# Altium project VM03_hv3.PrjPcb
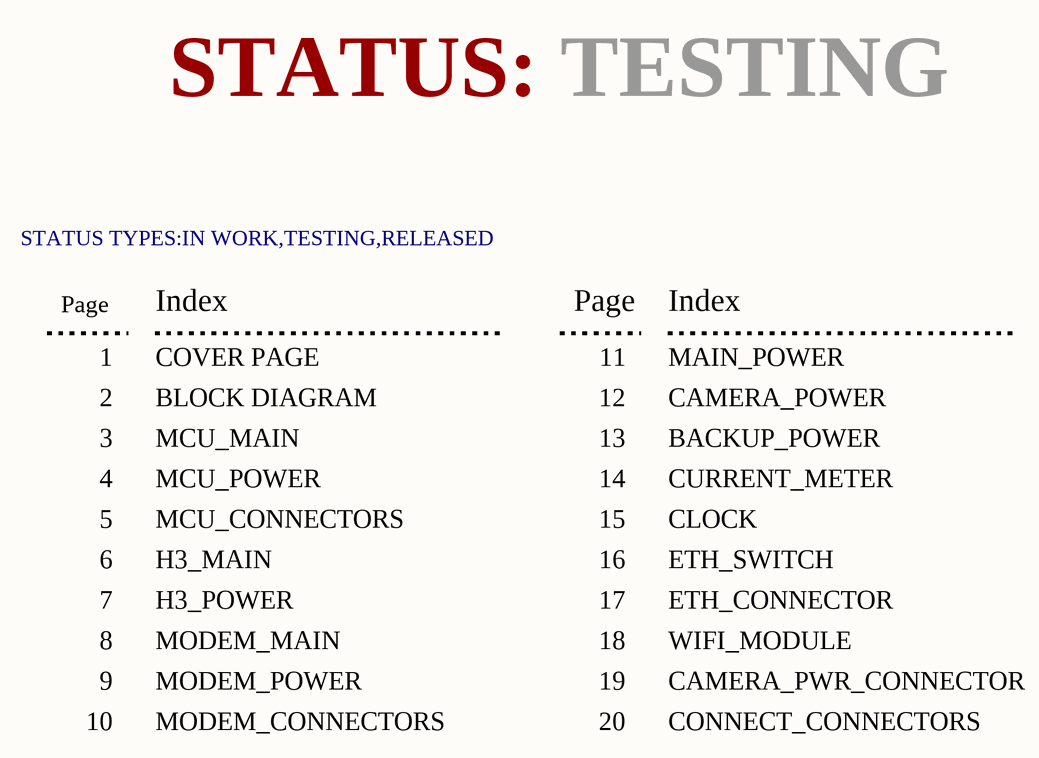
[diagram p0: [1]-COVER_PAGE.SchDoc]
20 sheets, 262 parts. Net scope: flat (ports and power ports of the same name join across sheets).
Board file: VM03_hv3.PcbDoc
Sheets:
  [1]-COVER_PAGE.SchDoc
  [2]-BLOCK_DIAGRAM.SchDoc
  [3]-MCU_MAIN.SchDoc
  [4]-MCU_POWER.SchDoc
  [5]-MCU_CONNECTORS.SchDoc
  [6]-H3_MAIN.SchDoc
  [7]-H3_POWER.SchDoc
  [8]-MODEM_MAIN.SchDoc
  [9]-MODEM_POWER.SchDoc
  [10]-MODEM_CONNECTORS.SchDoc
  [11]-MAIN_POWER.SchDoc
  [12]-CAMERA_POWER.SchDoc
  [13]-BACKUP_POWER.SchDoc
  [14]-CURRENT_METER.SchDoc
  [15]-CLOCK.SchDoc
  [16]-ETH_SWITCH.SchDoc
  [18]-WIFI_MODULE.SchDoc
  [19]-CAMERA_PWR_CONNECTORS.SchDoc
  [20]-CONNECT_CONNECTORS.SchDoc
  [21]-AXEL.SchDoc

## Sheet [1]-COVER_PAGE.SchDoc
size A4

### Notes on the sheet
- STATUS:
- TESTING
- STATUS TYPES:IN WORK,TESTING,RELEASED
- Page
- 1
- Index
- COVER PAGE
- 11
- MAIN_POWER
- 2
- BLOCK DIAGRAM
- 12
- CAMERA_POWER
- 3
- 4
- MCU_MAIN
- MCU_POWER
- 13
- 14
- BACKUP_POWER
- CURRENT_METER
- 5
- 6
- MCU_CONNECTORS
- H3_MAIN
- 15
- 16
- CLOCK
- ETH_SWITCH
- 7
- H3_POWER
- 17
- ETH_CONNECTOR
- 8
- 9
- MODEM_MAIN
- MODEM_POWER
- 18
- 19
- WIFI_MODULE
- CAMERA_PWR_CONNECTOR
- 10
- MODEM_CONNECTORS
- 20
- CONNECT_CONNECTORS

## Sheet [2]-BLOCK_DIAGRAM.SchDoc
size A4
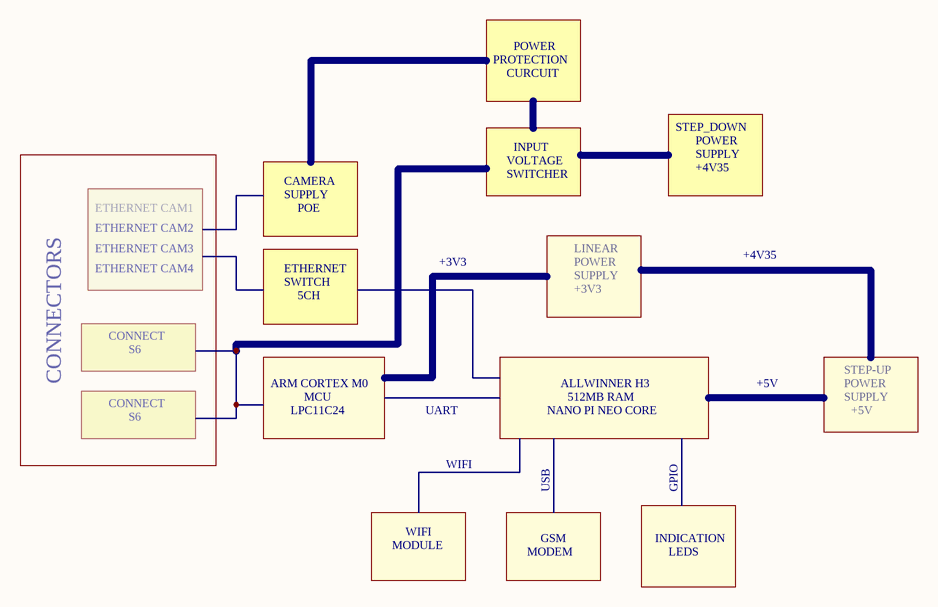
[diagram p1: [2]-BLOCK_DIAGRAM.SchDoc]

### Notes on the sheet
- POWER
- PROTECTION
- CURCUIT
- CAMERA
- VOLTAGE
- SWITCHER
- INPUT
- STEP_DOWN
- SUPPLY
- +4V35
- ETHERNET CAM1
- ETHERNET CAM2
- ETHERNET CAM3
- POE
- LINEAR
- ETHERNET CAM4
- ETHERNET
- SWITCH
- 5CH
- +3V3
- CONNECTORS
- CONNECT
- S6
- ARM CORTEX M0
- ALLWINNER H3
- +5V
- STEP-UP
- LPC11C24
- MCU
- UART
- NANO PI NEO CORE
- 512MB RAM
- WIFI
- USB
- GPIO
- MODULE
- MODEM
- GSM
- INDICATION
- LEDS

## Sheet [3]-MCU_MAIN.SchDoc
size A4
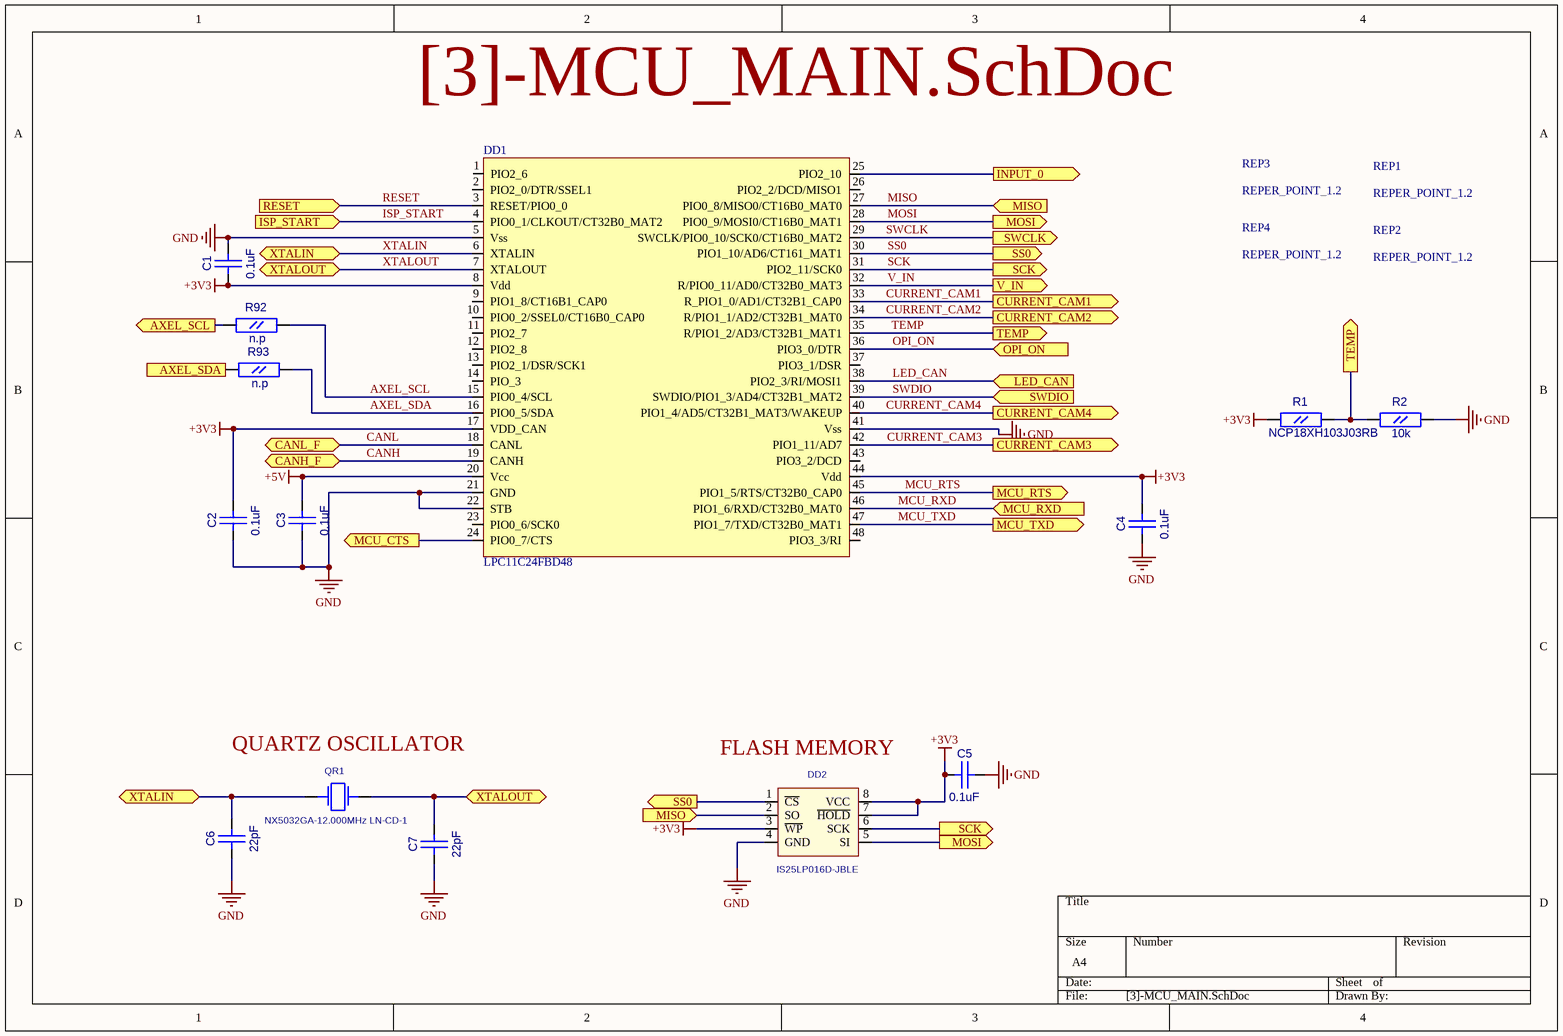
[diagram p2: [3]-MCU_MAIN.SchDoc]

### Parts
C1  0.1uF  [CC0603]
C2  0.1uF  [CC0603]
C3  0.1uF  [CC0603]
C4  0.1uF  [CC0603]
C5  0.1uF  [CC0603]
C6  22pF  [CC0603]
C7  22pF  [CC0603]
DD1  LPC11C24FBD48  [LQFP48]
DD2  IS25LP016D-JBLE  [EIAJ_SO8]
QR1  NX5032GA-12.000MHz LN-CD-1  [AC5032_2]
R1  NCP18XH103J03RB  [RC0603]
R2  10k  [RC0603]
R92  n.p  [RC0603]
R93  n.p  [RC0603]
REP1  REPER_POINT_1.2  [REPER1.2]
REP2  REPER_POINT_1.2  [REPER1.2]
REP3  REPER_POINT_1.2  [REPER1.2]
REP4  REPER_POINT_1.2  [REPER1.2]

### Ports
AXEL_SCL (out), AXEL_SDA (out), CANH_F (bidir), CANL_F (bidir), CURRENT_CAM1 (out), CURRENT_CAM2 (out), CURRENT_CAM3 (out), CURRENT_CAM4 (out), INPUT_0 (out), ISP_START (in), LED_CAN (in), MCU_CTS (out), MCU_RTS (out), MCU_RXD (in), MCU_TXD (out), MISO (in), MOSI (out), OPI_ON (in), RESET (in), SCK (out), SS0 (out), SWCLK (out), SWDIO (in), TEMP (out), V_IN (out), XTALIN (bidir), XTALOUT (bidir)

### Nets
+3V3: C1.1(A) C2.2(B) C4.2(B) C5.1(A) DD1.8(Vdd) DD1.17(VDD_CAN) DD1.44(Vdd) DD2.3(~{WP}) DD2.7(~{HOLD}) DD2.8(VCC) R1.1(A)
+5V: C3.2(B) DD1.20(Vcc)
GND: C1.2(B) C2.1(A) C3.1(A) C4.1(A) C5.2(B) C6.1(A) C7.1(A) DD1.5(Vss) DD1.21(GND) DD1.22(STB) DD1.41(Vss) DD2.4(GND) R2.2(B)
AXEL_SCL: DD1.15(PIO0_4/SCL) R92.2(B)
AXEL_SDA: DD1.16(PIO0_5/SDA) R93.2(B)
CANH: DD1.19(CANH) ; port CANH_F
CANL: DD1.18(CANL) ; port CANL_F
CURRENT_CAM1: DD1.33(R_PIO1_0/AD1/CT32B1_CAP0) ; port CURRENT_CAM1
CURRENT_CAM2: DD1.34(R/PIO1_1/AD2/CT32B1_MAT0) ; port CURRENT_CAM2
CURRENT_CAM3: DD1.42(PIO1_11/AD7) ; port CURRENT_CAM3
CURRENT_CAM4: DD1.40(PIO1_4/AD5/CT32B1_MAT3/WAKEUP) ; port CURRENT_CAM4
INPUT_0: DD1.25(PIO2_10) ; port INPUT_0
ISP_START: DD1.4(PIO0_1/CLKOUT/CT32B0_MAT2) ; port ISP_START
LED_CAN: DD1.38(PIO2_3/RI/MOSI1) ; port LED_CAN
MCU_RTS: DD1.45(PIO1_5/RTS/CT32B0_CAP0) ; port MCU_RTS
MCU_RXD: DD1.46(PIO1_6/RXD/CT32B0_MAT0) ; port MCU_RXD
MCU_TXD: DD1.47(PIO1_7/TXD/CT32B0_MAT1) ; port MCU_TXD
MISO: DD1.27(PIO0_8/MISO0/CT16B0_MAT0) DD2.2(SO) ; port MISO
MOSI: DD1.28(PIO0_9/MOSI0/CT16B0_MAT1) DD2.5(SI) ; port MOSI
OPI_ON: DD1.36(PIO3_0/DTR) ; port OPI_ON
RESET: DD1.3(RESET/PIO0_0) ; port RESET
SCK: DD1.31(PIO2_11/SCK0) DD2.6(SCK) ; port SCK
SS0: DD1.30(PIO1_10/AD6/CT161_MAT1) DD2.1(~{CS}) ; port SS0
SWCLK: DD1.29(SWCLK/PIO0_10/SCK0/CT16B0_MAT2) ; port SWCLK
SWDIO: DD1.39(SWDIO/PIO1_3/AD4/CT32B1_MAT2) ; port SWDIO
TEMP: DD1.35(R/PIO1_2/AD3/CT32B1_MAT1) R1.2(B) R2.1(A) ; port TEMP
V_IN: DD1.32(R/PIO0_11/AD0/CT32B0_MAT3) ; port V_IN
XTALIN: C6.2(B) DD1.6(XTALIN) QR1.1 ; port XTALIN
XTALOUT: C7.2(B) DD1.7(XTALOUT) QR1.2 ; port XTALOUT
NetDA6_2: R93.1(A) ; port AXEL_SDA
NetDA6_12: R92.1(A) ; port AXEL_SCL
NetDD1_24: DD1.24(PIO0_7/CTS) ; port MCU_CTS

Not connected (* = marked no-connect by the designer): DD1 1(PIO2_6) 2(PIO2_0/DTR/SSEL1) 9(PIO1_8/CT16B1_CAP0) 10(PIO0_2/SSEL0/CT16B0_CAP0) 11(PIO2_7) 12(PIO2_8) 13(PIO2_1/DSR/SCK1) 14(PIO_3) 23(PIO0_6/SCK0) 26(PIO2_2/DCD/MISO1) 37(PIO3_1/DSR) 43(PIO3_2/DCD) 48(PIO3_3/RI); REP1 1; REP2 1; REP3 1; REP4 1

### Notes on the sheet
- (near QR1) QUARTZ OSCILLATOR
- (near DD2) FLASH MEMORY

### Library data of the parts
C1-C7 = CC0603
  C1-C5: Value: 0.1uF
  C6 C7: Value: 22pF
DD2 = S25FL016A0LMFI01: Value: IS25LP016D-JBLE
QR1 = AC5032_2: AC5032/2; Value: NX5032GA-12.000MHz LN-CD-1
R1 R2 R92 R93 = RC0603
  R1: Value: NCP18XH103J03RB
  R2: Value: 10k
  R92 R93: Value: n.p
REP1-REP4 = REPER1.2: Value: REPER_POINT_1.2
DD1 = LPC11C24FBD48: Value: LPC11C24FBD48

## Sheet [4]-MCU_POWER.SchDoc
size A4
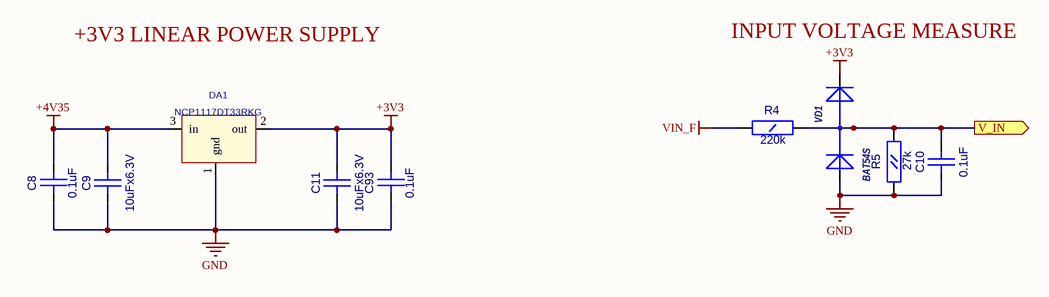
[diagram p3: [4]-MCU_POWER.SchDoc]

### Parts
C8  0.1uF  [CC0603]
C9  10uFx6.3V  [CC0805]
C10  0.1uF  [CC0603]
C11  10uFx6.3V  [CC0805]
C93  0.1uF  [CC0603]
DA1  NCP1117DT33RKG  [SOT-223]
R4  220k  [RC1206]
R5  27k  [RC0603]
VD1  BAT54S  [SOT-23(GSD)]

### Ports
V_IN (out)

### Nets
+3V3: C11.2(B) C93.1(A) DA1.2(out) VD1.2(K)
+4V35: C8.1(A) C9.2(B) DA1.3(in)
GND: C8.2(B) C9.1(A) C10.1(A) C11.1(A) C93.2(B) DA1.1(gnd) R5.1(A) VD1.1(A)
VIN_F: R4.1(A)
V_IN: C10.2(B) R4.2(B) R5.2(B) VD1.3(AK) ; port V_IN

### Notes on the sheet
- +3V3 LINEAR POWER SUPPLY
- (near VD1) INPUT VOLTAGE MEASURE

### Library data of the parts
C8 C10 C93 = CC0603: Value: 0.1uF
C9 C11 = CC0805: Value: 10uFx6.3V
DA1 = NCP1117DT33RKG: Linear Regulator 3.3V; Value: *
R4 = RC1206: Value: 220k
R5 = RC0603: Value: 27k
VD1 = BAT54S: 1.0 Ampere General Purpose Rectifier; ComponentField6: Published 8-Jun-2000, Modified 11-July-2000: SIM Model Added.; Value: *

## Sheet [5]-MCU_CONNECTORS.SchDoc
size A4
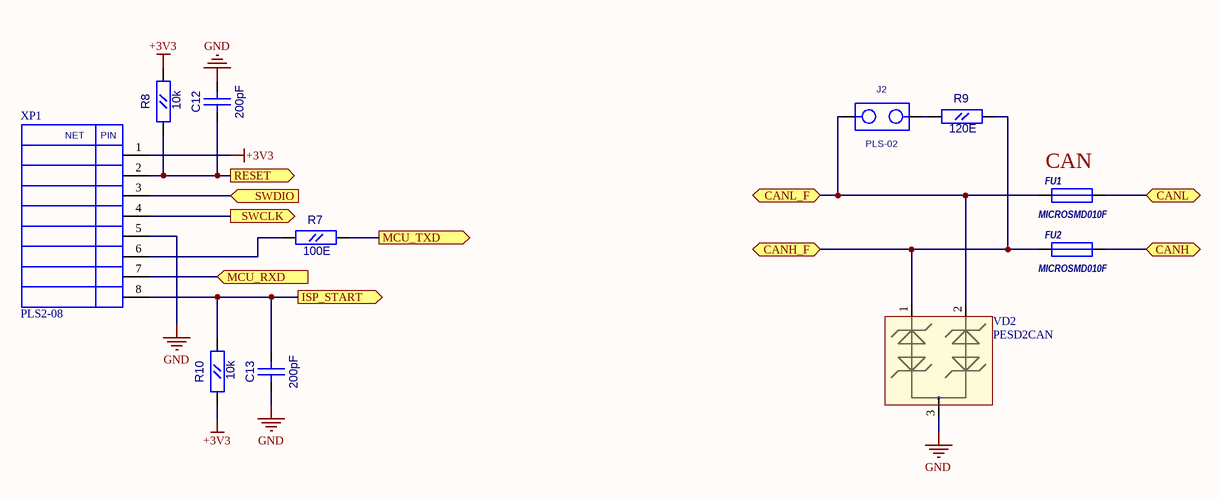
[diagram p4: [5]-MCU_CONNECTORS.SchDoc]

### Parts
C12  200pF  [CC0603]
C13  200pF  [CC0603]
FU1  MICROSMD010F  [RC1210]
FU2  MICROSMD010F  [RC1210]
J2  PLS-02  [PLS-02]
R7  100E  [RC0603]
R8  10k  [RC0603]
R9  120E  [RC0805]
R10  10k  [RC0603]
VD2  PESD2CAN  [SOT-23(123)]
XP1  PLS2-08  [PLS2-08]

### Ports
CANH (bidir), CANH_F (bidir), CANL (bidir), CANL_F (bidir), ISP_START (out), MCU_RXD (in), MCU_TXD (out), RESET (out), SWCLK (out), SWDIO (in)

### Nets
+3V3: R8.2(B) R10.1(A) XP1.1
GND: C12.2(B) C13.1(A) VD2.3 XP1.5
CANH: FU2.1 R9.2(B) VD2.1 ; port CANH_F
CANL: FU1.1 J2.1 VD2.2 ; port CANL_F
ISP_START: C13.2(B) R10.2(B) XP1.8 ; port ISP_START
MCU_RXD: XP1.7 ; port MCU_RXD
MCU_TXD: R7.2(B) ; port MCU_TXD
RESET: C12.1(A) R8.1(A) XP1.2 ; port RESET
SWCLK: XP1.4 ; port SWCLK
SWDIO: XP1.3 ; port SWDIO
NetFU1_2: FU1.2 ; port CANL
NetFU2_2: FU2.2 ; port CANH
NetJ2_2: J2.2 R9.1(A)
NetR7_1: R7.1(A) XP1.6

### Notes on the sheet
- (near FU1) CAN
- (in symbol PLS2-08) NET; PIN

### Library data of the parts
C12 C13 = CC0603: Value: 200pF
FU1 FU2 = MICROSMD: Value: *
R7 R8 R10 = RC0603
  R7: Value: 100E
  R8 R10: Value: 10k
R9 = RC0805: Value: 120E
VD2 = PESD2CAN: TVS for CAN
J2 = PLS-02: Value: *

## Sheet [6]-H3_MAIN.SchDoc
size A4
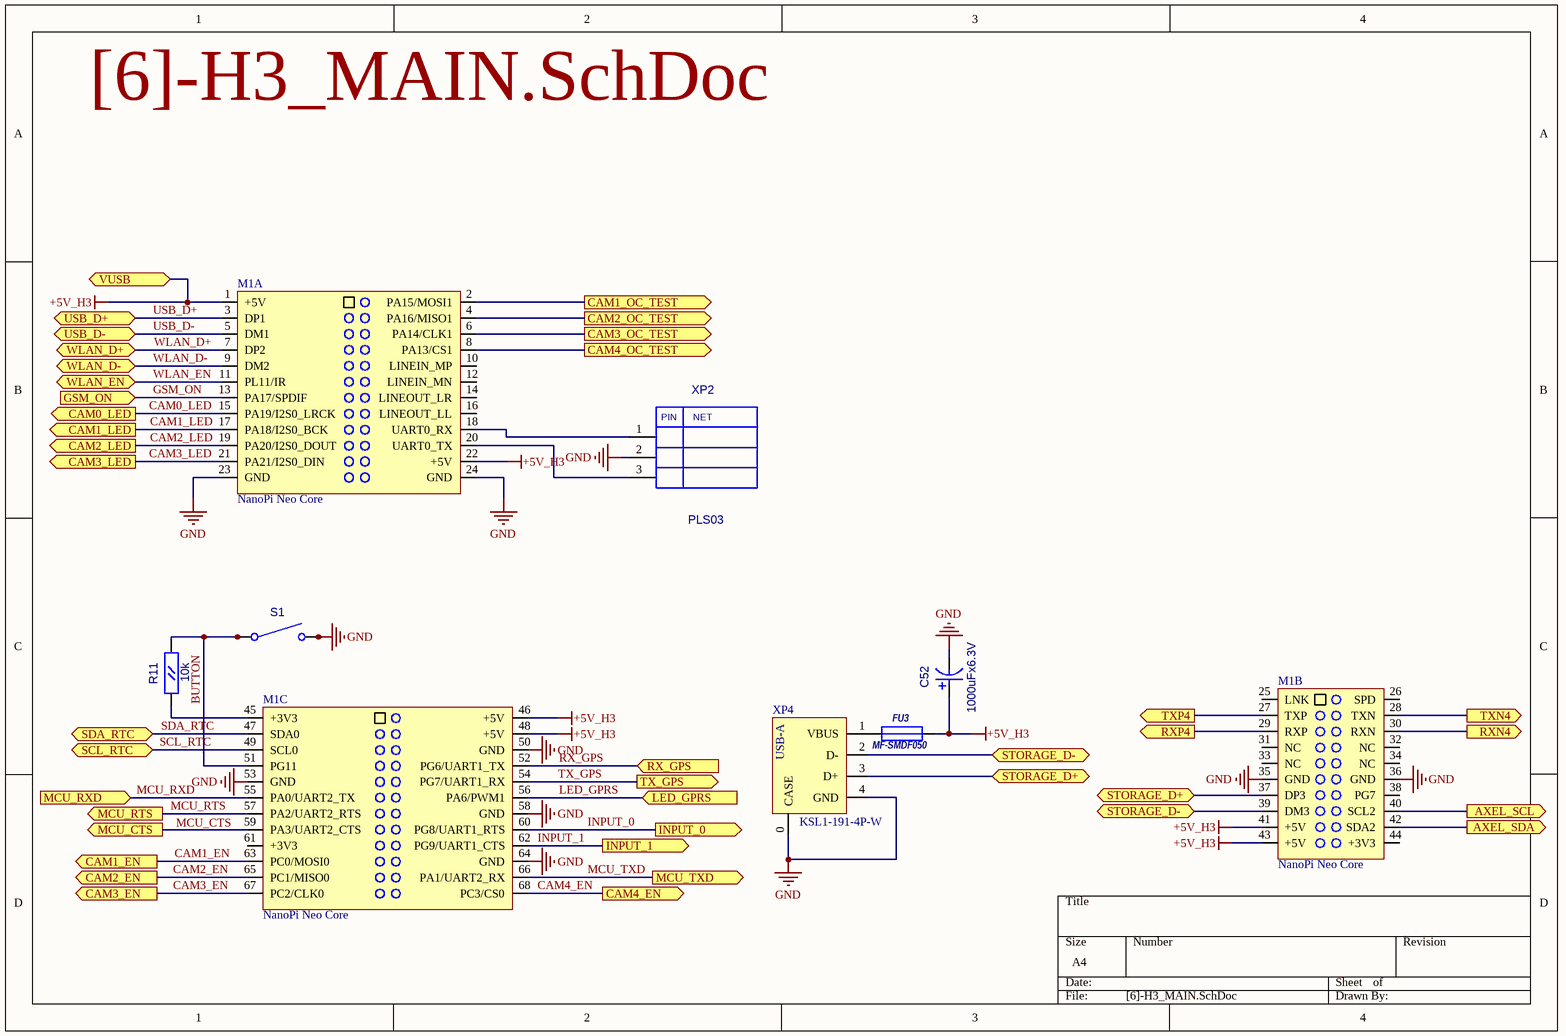
[diagram p5: [6]-H3_MAIN.SchDoc]

### Parts
C52  value 1000uFx6.3V  [CC8X3.5]  (hidden comment: CAP0.35)
FU3  MF-SMDF050  [MF-SMDF]
M1  NanoPi Neo Core  [NanoPiNeo_CORE]  (parts A,B,C of 3)
R11  10k  [RC0603]
S1  DTSM-61N  [DTSM-61N]  (value not drawn)
XP2  PLS03  [PLS-03]
XP4  KSL1-191-4P-W  [USB_A_REAR]

### Ports
AXEL_SCL (out), AXEL_SDA (out), CAM0_LED (out), CAM1_EN (out), CAM1_LED (out), CAM1_OC_TEST (out), CAM2_EN (out), CAM2_LED (out), CAM2_OC_TEST (out), CAM3_EN (out), CAM3_LED (out), CAM3_OC_TEST (out), CAM4_EN (out), CAM4_OC_TEST (out), GSM_ON (in), INPUT_0 (out), INPUT_1 (out), LED_GPRS (in), MCU_CTS (out), MCU_RTS (out), MCU_RXD (in), MCU_TXD (out), RX_GPS (in), RXN4 (out), RXP4 (out), SCL_RTC (bidir), SDA_RTC (bidir), STORAGE_D+ (bidir), STORAGE_D- (bidir), TX_GPS (out), TXN4 (out), TXP4 (out), USB_D+ (bidir), USB_D- (bidir), VUSB (bidir), WLAN_D+ (bidir), WLAN_D- (bidir), WLAN_EN (bidir)

### Nets
+5V_H3: C52.1 FU3.2 M1.1(+5V) M1.22(+5V) M1.41(+5V) M1.43(+5V) M1.46(+5V) M1.48(+5V) ; port VUSB  [project net VUSB]
GND: C52.2 M1.23(GND) M1.24(GND) M1.35(GND) M1.36(GND) M1.50(GND) M1.53(GND) M1.58(GND) M1.64(GND) S1.3(C2) S1.4 XP2.2 XP4.0(CASE) XP4.4(GND)
BUTTON: M1.51(PG11) R11.2(B) S1.1(C1) S1.2
CAM0_LED: M1.15(PA19/I2S0_LRCK) ; port CAM0_LED
CAM1_EN: M1.63(PC0/MOSI0) ; port CAM1_EN
CAM1_LED: M1.17(PA18/I2S0_BCK) ; port CAM1_LED
CAM2_EN: M1.65(PC1/MISO0) ; port CAM2_EN
CAM2_LED: M1.19(PA20/I2S0_DOUT) ; port CAM2_LED
CAM3_EN: M1.67(PC2/CLK0) ; port CAM3_EN
CAM3_LED: M1.21(PA21/I2S0_DIN) ; port CAM3_LED
CAM4_EN: M1.68(PC3/CS0) ; port CAM4_EN
GSM_ON: M1.13(PA17/SPDIF) ; port GSM_ON
INPUT_0: M1.60(PG8/UART1_RTS) ; port INPUT_0
INPUT_1: M1.62(PG9/UART1_CTS) ; port INPUT_1
LED_GPRS: M1.56(PA6/PWM1) ; port LED_GPRS
MCU_RTS: M1.57(PA2/UART2_RTS) ; port MCU_RTS
MCU_RXD: M1.55(PA0/UART2_TX) ; port MCU_RXD
MCU_TXD: M1.66(PA1/UART2_RX) ; port MCU_TXD
RX_GPS: M1.52(PG6/UART1_TX) ; port RX_GPS
SCL_RTC: M1.49(SCL0) ; port SCL_RTC
SDA_RTC: M1.47(SDA0) ; port SDA_RTC
TX_GPS: M1.54(PG7/UART1_RX) ; port TX_GPS
USB_D+: M1.3(DP1) ; port USB_D+
USB_D-: M1.5(DM1) ; port USB_D-
WLAN_D+: M1.7(DP2) ; port WLAN_D+
WLAN_D-: M1.9(DM2) ; port WLAN_D-
WLAN_EN: M1.11(PL11/IR) ; port WLAN_EN
NetC82_2: M1.2(PA15/MOSI1) ; port CAM1_OC_TEST
NetC83_2: M1.6(PA14/CLK1) ; port CAM3_OC_TEST
NetC84_2: M1.8(PA13/CS1) ; port CAM4_OC_TEST
NetC85_2: M1.4(PA16/MISO1) ; port CAM2_OC_TEST
NetDA6_2: M1.42(SDA2) ; port AXEL_SDA
NetDA6_12: M1.40(SCL2) ; port AXEL_SCL
NetDD1_24: M1.59(PA3/UART2_CTS) ; port MCU_CTS
NetDD4_19: M1.27(TXP) ; port TXP4
NetDD4_20: M1.28(TXN) ; port TXN4
NetDD4_21: M1.30(RXN) ; port RXN4
NetDD4_22: M1.29(RXP) ; port RXP4
NetFU3_1: FU3.1 XP4.1(VBUS)
NetM1_18: M1.18(UART0_RX) XP2.1
NetM1_20: M1.20(UART0_TX) XP2.3
NetM1_37: M1.37(DP3) XP4.3(D+) ; port STORAGE_D+
NetM1_39: M1.39(DM3) XP4.2(D-) ; port STORAGE_D-
NetM1_45: M1.45(+3V3) R11.1(A)

Not connected (* = marked no-connect by the designer): M1 10(LINEIN_MP) 12(LINEIN_MN) 14(LINEOUT_LR) 16(LINEOUT_LL) 25(LNK) 26(SPD) 31(NC) 32(NC) 33(NC) 34(NC) 38(PG7) 44(+3V3) 61(+3V3)

### Notes on the sheet
- Labels drawn without touching a wire or pin: MCU_CTS
- (in symbol PLS03) PIN; NET
- (in symbol USB_A_REAR) USB-A

### Library data of the parts
FU3 = MF-SMDF: Value: *
M1 = NanoPi Neo Core: Nano Pi Neo Core Allwinner H3 based embedded module; Value: NanoPi Neo Core
R11 = RC0603: Value: 10k
S1 = DTSM-61N: Switch, Single Pole, Single Throw, Normally Open; Value: {Value}
XP4 = USB_A_REAR: USB A rear side connector; Value: KSL1-191-4P-W
XP2 = PLS03: Value: *

## Sheet [7]-H3_POWER.SchDoc
size A4
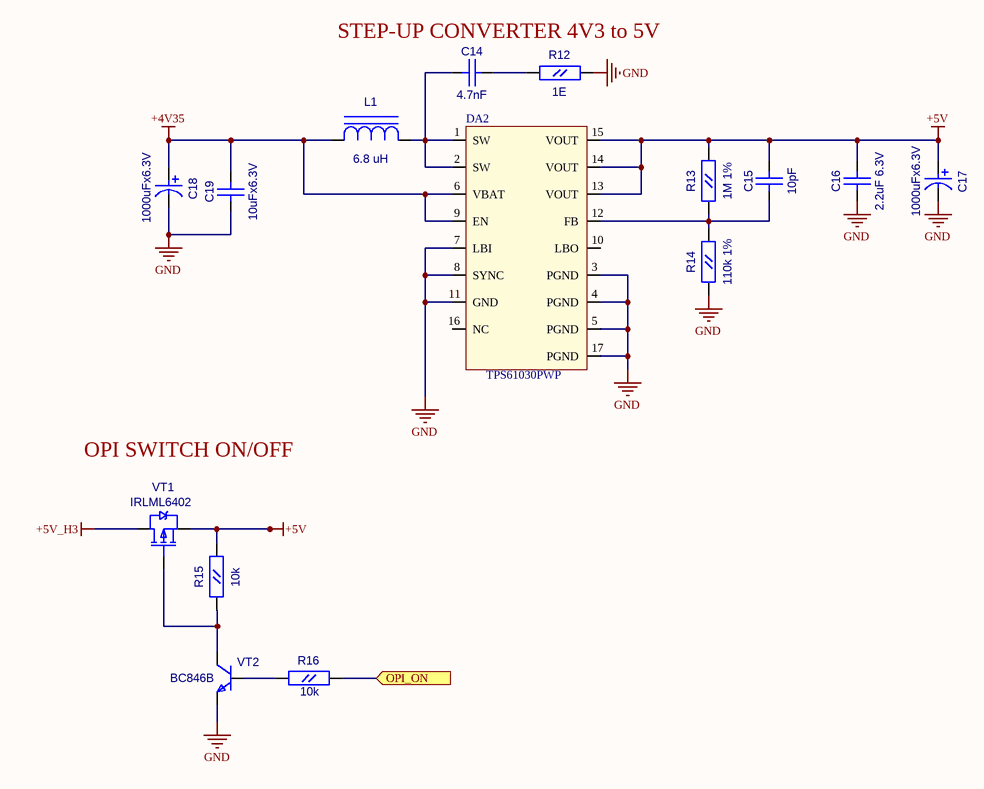
[diagram p6: [7]-H3_POWER.SchDoc]

### Parts
C14  4.7nF  [CC0603]
C15  10pF  [CC0603]
C16  2.2uF 6.3V  [CC0805]
C17  value 1000uFx6.3V  [CC8X3.5]  (hidden comment: CAP0.35)
C18  value 1000uFx6.3V  [CC8X3.5]  (hidden comment: CAP0.35)
C19  10uFx6.3V  [CC0805]
DA2  TPS61030PWP  [R-PDSO-G16]
L1  6.8 uH  [SDR0805]
R12  1E  [RC0603]
R13  1M 1%  [RC0603]
R14  110k 1%  [RC0603]
R15  10k  [RC0603]
R16  10k  [RC0603]
VT1  IRLML6402  [SOT-23(123)]
VT2  BC846B  [SOT-23(123)]

### Ports
OPI_ON (in)

### Nets
+4V35: C18.1 C19.2(B) DA2.6(VBAT) DA2.9(EN) L1.1(C)
+5V: C15.2(B) C16.2(B) C17.1 DA2.13(VOUT) DA2.14(VOUT) DA2.15(VOUT) R13.2(B) R15.2(B) VT1.2(S)
+5V_H3: VT1.3(D)  [project net VUSB]
GND: C16.1(A) C17.2 C18.2 C19.1(A) DA2.3(PGND) DA2.4(PGND) DA2.5(PGND) DA2.7(LBI) DA2.8(SYNC) DA2.11(GND) DA2.17(PGND) R12.2(B) R14.1(A) VT2.2(E)
OPI_ON: R16.2(B) ; port OPI_ON
NetC14_1: C14.1(A) DA2.1(SW) DA2.2(SW) L1.2(A)
NetC14_2: C14.2(B) R12.1(A)
NetC15_1: C15.1(A) DA2.12(FB) R13.1(A) R14.2(B)
NetR15_1: R15.1(A) VT1.1(G) VT2.3(C)
NetR16_1: R16.1(A) VT2.1(B)

Not connected (* = marked no-connect by the designer): DA2 10(LBO) 16(NC)

### Notes on the sheet
- STEP-UP CONVERTER 4V3 to 5V
- OPI SWITCH ON/OFF

### Library data of the parts
C14 C15 = CC0603
  C14: Value: 4.7nF
  C15: Value: 10pF
C16 C19 = CC0805
  C16: Value: 2.2uF 6.3V
  C19: Value: 10uFx6.3V
DA2 = TPS61030PWP: Boost converter
L1 = SDR0805: Value: 6.8 uH
R12-R16 = RC0603
  R12: Value: 1E
  R13: Value: 1M 1%
  R14: Value: 110k 1%
  R15 R16: Value: 10k
VT1 = IRLML6402: HEXFET Power MOSFET; OriginalName: IRLML5103; ComponentField7: Published 8-Jun-2000; Value: IRLML6402
VT2 = BC846BLT1: ComponentField7: Published 29-Sep-2000; OriginalName: BC846BLT1; Value: BC846B

## Sheet [8]-MODEM_MAIN.SchDoc
size A4
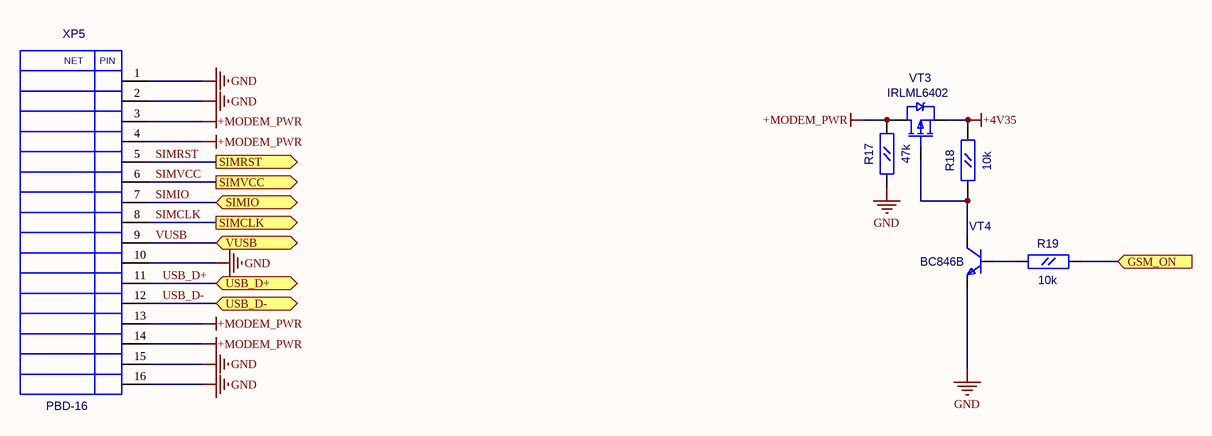
[diagram p7: [8]-MODEM_MAIN.SchDoc]

### Parts
R17  47k  [RC0603]
R18  10k  [RC0603]
R19  10k  [RC0603]
VT3  IRLML6402  [SOT-23(123)]
VT4  BC846B  [SOT-23(123)]
XP5  PBD-16  [PBD16]

### Ports
GSM_ON (in), SIMCLK (out), SIMIO (bidir), SIMRST (out), SIMVCC (out), USB_D+ (bidir), USB_D- (bidir), VUSB (bidir)

### Nets
+4V35: R18.2(B) VT3.2(S)
+MODEM_PWR: R17.2(B) VT3.3(D) XP5.3 XP5.4 XP5.13 XP5.14
GND: R17.1(A) VT4.2(E) XP5.1 XP5.2 XP5.10 XP5.15 XP5.16
VUSB: XP5.9 ; port VUSB
GSM_ON: R19.2(B) ; port GSM_ON
SIMCLK: XP5.8 ; port SIMCLK
SIMIO: XP5.7 ; port SIMIO
SIMRST: XP5.5 ; port SIMRST
SIMVCC: XP5.6 ; port SIMVCC
USB_D+: XP5.11 ; port USB_D+
USB_D-: XP5.12 ; port USB_D-
NetR18_1: R18.1(A) VT3.1(G) VT4.3(C)
NetR19_1: R19.1(A) VT4.1(B)

### Notes on the sheet
- (in symbol PBD-16) NET; PIN

### Library data of the parts
R17-R19 = RC0603
  R17: Value: 47k
  R18 R19: Value: 10k
VT3 = IRLML6402: as VT1 on sheet [7]-H3_POWER; Value: IRLML6402
VT4 = BC846BLT1: ComponentField7: Published 29-Sep-2000; OriginalName: BC846BLT1; Value: BC846B
XP5 = PBD-16: Value: *

## Sheet [9]-MODEM_POWER.SchDoc
size A4
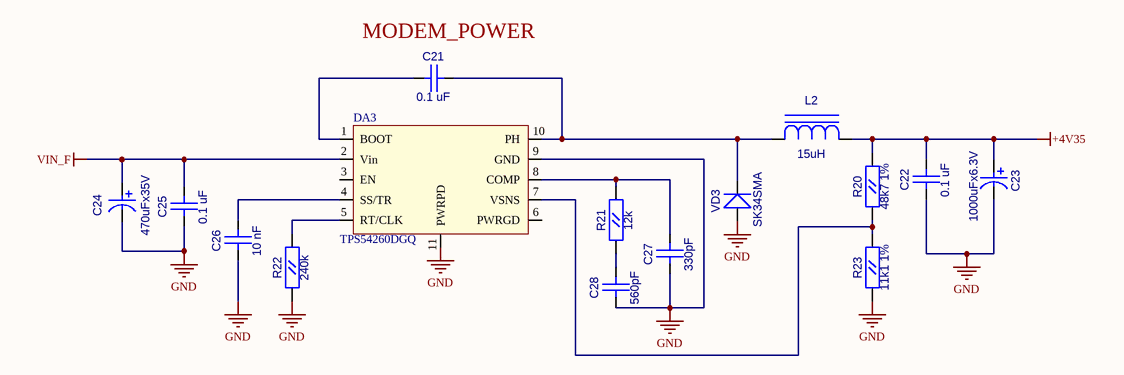
[diagram p8: [9]-MODEM_POWER.SchDoc]

### Parts
C21  0.1 uF  [CC0603]
C22  0.1 uF  [CC0603]
C23  1000uFx6.3V  [CC8X3.5]
C24  470uFx35V  [CC16X10_CAP0.5(1)(Primary)]
C25  0.1 uF  [CC0603]
C26  10 nF  [CC0603]
C27  330pF  [CC0603]
C28  560pF  [CC0603]
DA3  TPS54260DGQ  [S-PDSO-G10]
L2  15uH  [SDR0805]
R20  48k7 1%  [RC0603]
R21  12k  [RC0603]
R22  240k  [RC0603]
R23  11k1 1%  [RC0603]
VD3  SK34SMA  [SMA]

### Nets
+4V35: C22.1(A) C23.1 L2.2(A) R20.2(B)
GND: C22.2(B) C23.2 C24.1 C25.2(B) C26.2(B) C27.2(B) C28.2(B) DA3.9(GND) DA3.11(PWRPD) R22.1(A) R23.1(A) VD3.1(A)
VIN_F: C24.2 C25.1(A) DA3.2(Vin)
NetC21_1: C21.1(A) DA3.10(PH) L2.1(C) VD3.2(K)
NetC21_2: C21.2(B) DA3.1(BOOT)
NetC26_1: C26.1(A) DA3.4(SS/TR)
NetC27_1: C27.1(A) DA3.8(COMP) R21.2(B)
NetC28_1: C28.1(A) R21.1(A)
NetDA3_5: DA3.5(RT/CLK) R22.2(B)
NetDA3_7: DA3.7(VSNS) R20.1(A) R23.2(B)

Not connected (* = marked no-connect by the designer): DA3 3(EN) 6(PWRGD)

### Notes on the sheet
- (near C21) MODEM_POWER

### Library data of the parts
C21 C22 C25-C28 = CC0603
  C21 C22 C25: Value: 0.1 uF
  C26: Value: 10 nF
  C27: Value: 330pF
  C28: Value: 560pF
C23 = CAP0.35: Value: 1000uFx6.3V
C24 = CAP0.5(1): Value: 470uFx35V
L2 = SDR0805: Value: 15uH
R20-R23 = RC0603
  R20: Value: 48k7 1%
  R21: Value: 12k
  R22: Value: 240k
  R23: Value: 11k1 1%
VD3 = SK34SMA: Schottky Rectifier; Value: {Value}

## Sheet [10]-MODEM_CONNECTORS.SchDoc
size A4
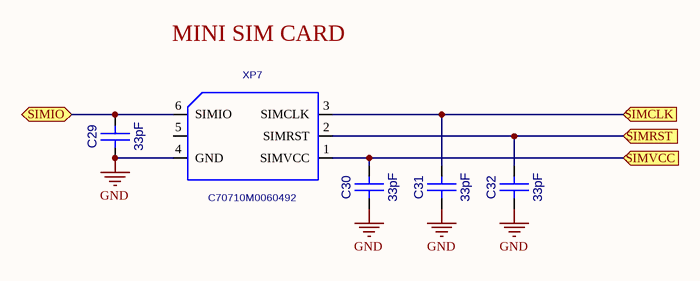
[diagram p9: [10]-MODEM_CONNECTORS.SchDoc]

### Parts
C29  33pF  [CC0603]
C30  33pF  [CC0603]
C31  33pF  [CC0603]
C32  33pF  [CC0603]
XP7  C70710M0060492  [SCVW06A25020]

### Ports
SIMCLK (in), SIMIO (bidir), SIMRST (in), SIMVCC (in)

### Nets
GND: C29.1(A) C30.1(A) C31.1(A) C32.1(A) XP7.4(GND)
SIMCLK: C31.2(B) XP7.3(SIMCLK) ; port SIMCLK
SIMIO: C29.2(B) XP7.6(SIMIO) ; port SIMIO
SIMRST: C32.2(B) XP7.2(SIMRST) ; port SIMRST
SIMVCC: C30.2(B) XP7.1(SIMVCC) ; port SIMVCC

Not connected (* = marked no-connect by the designer): XP7 5

### Notes on the sheet
- MINI SIM CARD

### Library data of the parts
C29-C32 = CC0603: Value: 33pF
XP7 = SCV-W06A25-020: Value: *

## Sheet [11]-MAIN_POWER.SchDoc
size A4
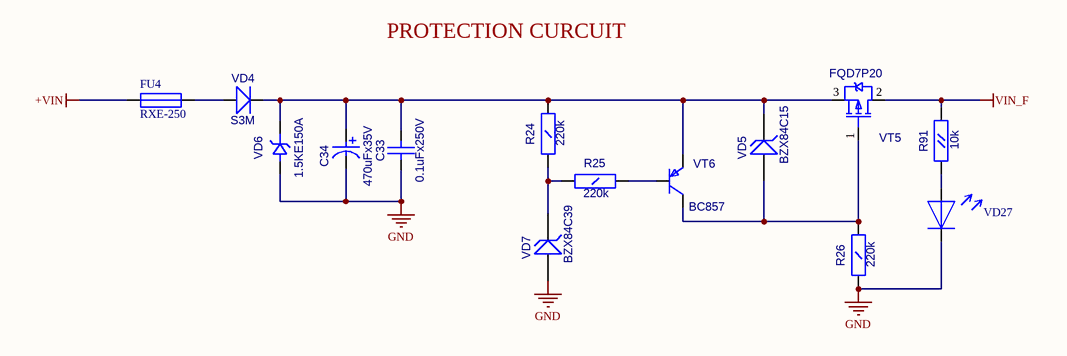
[diagram p10: [11]-MAIN_POWER.SchDoc]

### Parts
C33  0.1uFx250V  [CC1206]
C34  value 470uFx35V  [CC16X10_CAP0.5(1)(Primary)]  (hidden comment: CAP0.5(1))
FU4  RXE-250  [RXE-250_FLAT]
R24  220k  [RC1206]
R25  220k  [RC1206]
R26  220k  [RC1206]
R91  10k  [RC0603]
VD4  S3M  [SMC]
VD5  BZX84C15  [SOT-23(123)]
VD6  1.5KE150A  [DO-201_FLAT]
VD7  BZX84C39  [SOT-23(123)]
VD27  LED_0805  [LED0805]  (value not drawn)
VT5  FQD7P20  [D-PAK(TO-252AA)]
VT6  BC857  [SOT-23(123)]

### Nets
+VIN: FU4.1
GND: C33.1(A) C34.1 R26.1(A) VD6.1(A) VD7.1(A) VD27.2
VIN_F: R91.2(B) VT5.2(D)
NetC33_2: C33.2(B) C34.2 R24.2(B) VD4.2(K) VD5.3(K) VD6.2(K) VT5.3(S) VT6.2(E)
NetFU4_2: FU4.2 VD4.1(A)
NetR24_1: R24.1(A) R25.1(A) VD7.3(K)
NetR25_2: R25.2(B) VT6.1(B)
NetR26_2: R26.2(B) VD5.1(A) VT5.1(G) VT6.3(C)
NetR91_1: R91.1(A) VD27.1

### Notes on the sheet
- PROTECTION CURCUIT

### Library data of the parts
C33 = CC1206: Value: 0.1uFx250V
R24-R26 = RC1206: Value: 220k
R91 = RC0603: Value: 10k
VD4 = S3A: Schottky Rectifier; Value: S3M
VD5 VD7 = BZX84: Zener Voltage Regulator Diode
  VD5: Value: BZX84C15
  VD7: Value: BZX84C39
VD6 = 1.5KE: Value: 1.5KE150A
VT5 = IRFR9220: HEXFET Power MOSFET; OriginalName: IRLML5103; ComponentField7: Published 8-Jun-2000; Value: FQD7P20
VT6 = BC857B: PNP 100ma transistor; OriginalName: BC846BLT1; ComponentField7: Published 29-Sep-2000; Value: BC857
FU4 = RXE-250: Value: RXE-250
VD27 = LED_0805: Value: LED_0805

## Sheet [12]-CAMERA_POWER.SchDoc
size A4
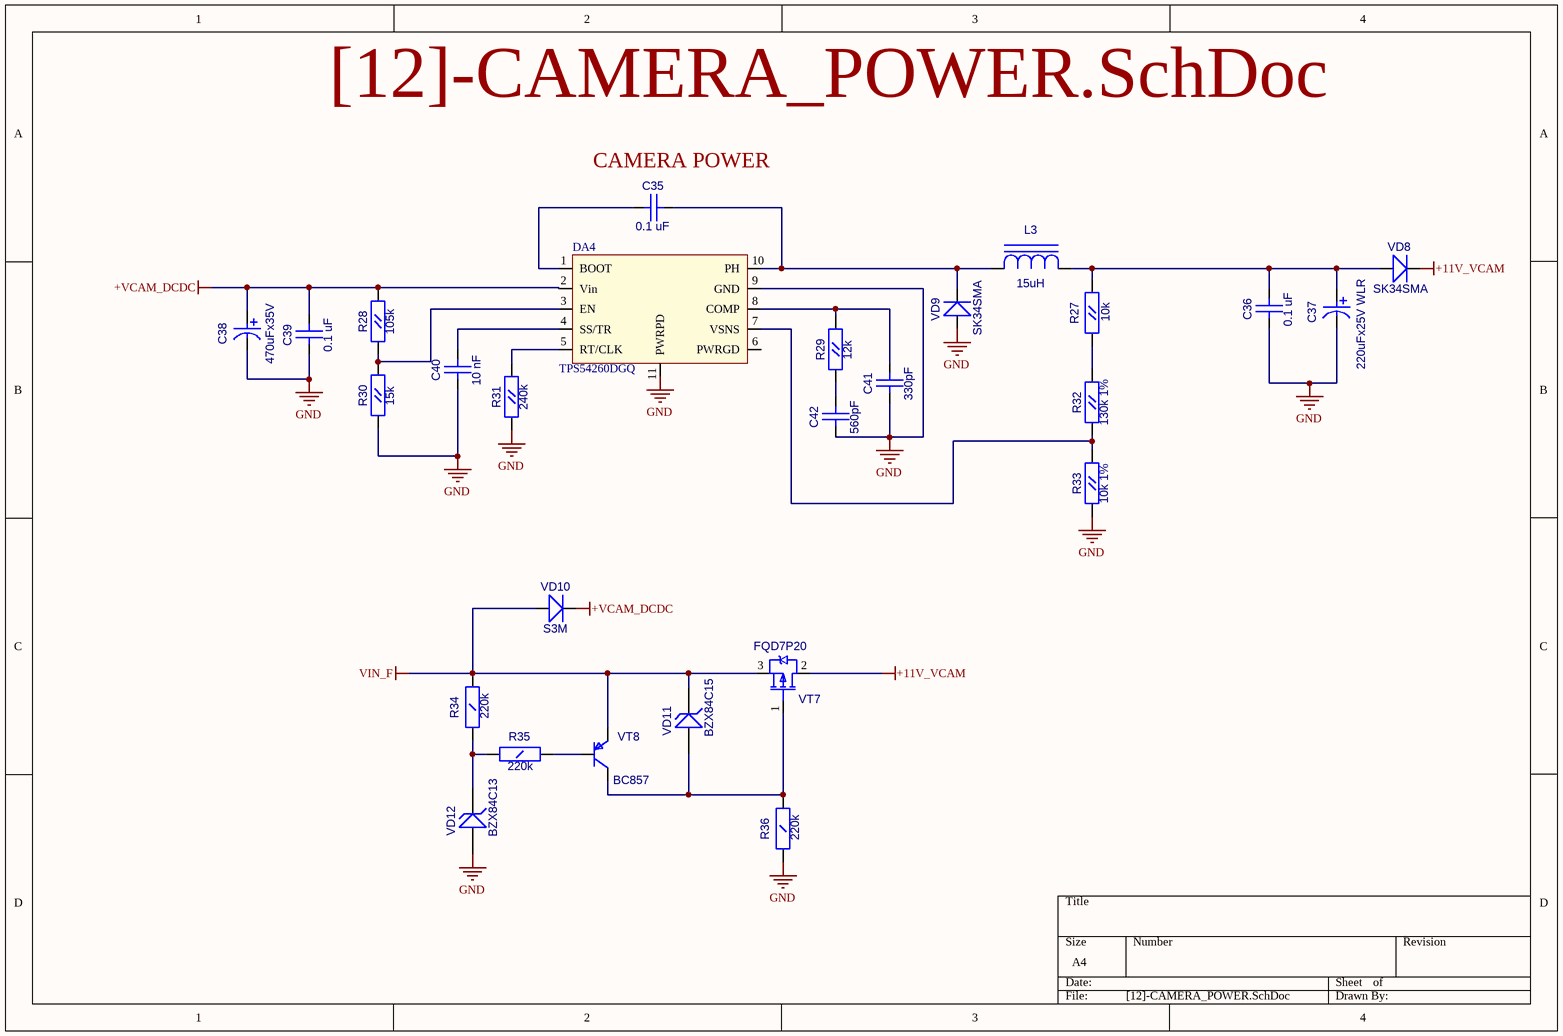
[diagram p11: [12]-CAMERA_POWER.SchDoc]

### Parts
C35  0.1 uF  [CC0603]
C36  0.1 uF  [CC0603]
C37  220uFx25V WLR  [CC8X3.5]
C38  470uFx35V  [CC16X10_CAP0.5(1)(Primary)]
C39  0.1 uF  [CC0603]
C40  10 nF  [CC0603]
C41  330pF  [CC0603]
C42  560pF  [CC0603]
DA4  TPS54260DGQ  [S-PDSO-G10]
L3  15uH  [SDR0805]
R27  10k  [RC0603]
R28  105k  [RC0603]
R29  12k  [RC0603]
R30  15k  [RC0603]
R31  240k  [RC0603]
R32  130k 1%  [RC0603]
R33  10k 1%  [RC0603]
R34  220k  [RC1206]
R35  220k  [RC1206]
R36  220k  [RC1206]
VD8  SK34SMA  [SMA]
VD9  SK34SMA  [SMA]
VD10  S3M  [SMC]
VD11  BZX84C15  [SOT-23(123)]
VD12  BZX84C13  [SOT-23(123)]
VT7  FQD7P20  [D-PAK(TO-252AA)]
VT8  BC857  [SOT-23(123)]

### Nets
+11V_VCAM: VD8.2(K) VT7.2(D)
+VCAM_DCDC: C38.2 C39.1(A) DA4.2(Vin) R28.2(B) VD10.2(K)
GND: C36.2(B) C37.2 C38.1 C39.2(B) C40.2(B) C41.2(B) C42.2(B) DA4.9(GND) DA4.11(PWRPD) R30.1(A) R31.1(A) R33.1(A) R36.1(A) VD9.1(A) VD12.1(A)
VIN_F: R34.2(B) VD10.1(A) VD11.3(K) VT7.3(S) VT8.2(E)
NetC35_1: C35.1(A) DA4.10(PH) L3.1(C) VD9.2(K)
NetC35_2: C35.2(B) DA4.1(BOOT)
NetC36_1: C36.1(A) C37.1 L3.2(A) R27.2(B) VD8.1(A)
NetC40_1: C40.1(A) DA4.4(SS/TR)
NetC41_1: C41.1(A) DA4.8(COMP) R29.2(B)
NetC42_1: C42.1(A) R29.1(A)
NetDA4_3: DA4.3(EN) R28.1(A) R30.2(B)
NetDA4_5: DA4.5(RT/CLK) R31.2(B)
NetDA4_7: DA4.7(VSNS) R32.1(A) R33.2(B)
NetR27_1: R27.1(A) R32.2(B)
NetR34_1: R34.1(A) R35.1(A) VD12.3(K)
NetR35_2: R35.2(B) VT8.1(B)
NetR36_2: R36.2(B) VD11.1(A) VT7.1(G) VT8.3(C)

Not connected (* = marked no-connect by the designer): DA4 6(PWRGD)

### Notes on the sheet
- (near C35) CAMERA POWER

### Library data of the parts
C35 C36 C39-C42 = CC0603
  C35 C36 C39: Value: 0.1 uF
  C40: Value: 10 nF
  C41: Value: 330pF
  C42: Value: 560pF
C37 = CAP0.35: Value: 220uFx25V WLR
C38 = CAP0.5(1): Value: 470uFx35V
L3 = SDR0805: Value: 15uH
R27-R33 = RC0603
  R27: Value: 10k
  R28: Value: 105k
  R29: Value: 12k
  R30: Value: 15k
  R31: Value: 240k
  R32: Value: 130k 1%
  R33: Value: 10k 1%
R34-R36 = RC1206: Value: 220k
VD8 VD9 = SK34SMA: Schottky Rectifier; Value: {Value}
VD10 = S3A: Schottky Rectifier; Value: S3M
VD11 VD12 = BZX84: Zener Voltage Regulator Diode
  VD11: Value: BZX84C15
  VD12: Value: BZX84C13
VT7 = IRFR9220: as VT5 on sheet [11]-MAIN_POWER; Value: FQD7P20
VT8 = BC857B: as VT6 on sheet [11]-MAIN_POWER; Value: BC857

## Sheet [13]-BACKUP_POWER.SchDoc
size A4
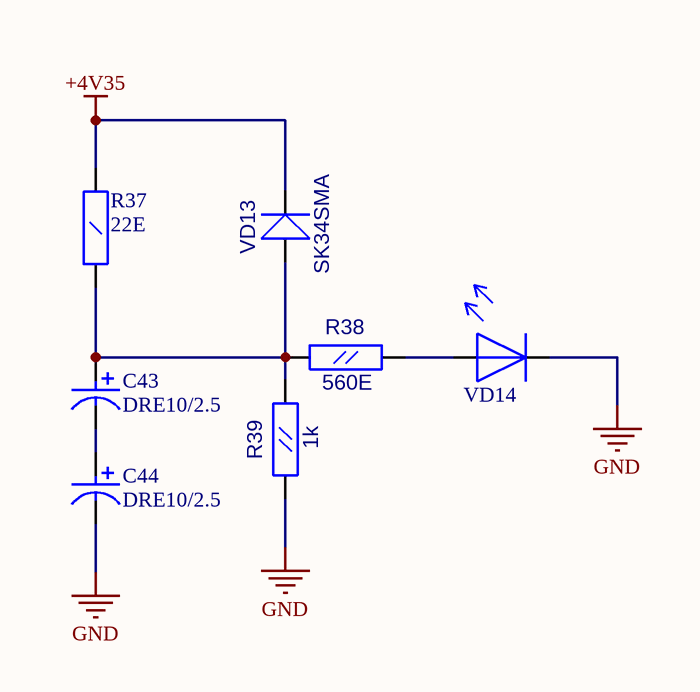
[diagram p12: [13]-BACKUP_POWER.SchDoc]

### Parts
C43  DRE10/2.5  [CAP_13x26]
C44  DRE10/2.5  [CAP_13x26]
R37  22E  [R2512]
R38  560E  [RC0603]
R39  1k  [RC0603]
VD13  SK34SMA  [SMA]
VD14  LED_0805  [LED0805]  (value not drawn)

### Nets
+4V35: R37.2(B) VD13.2(K)
GND: C44.1 R39.1(A) VD14.2
NetC43_1: C43.1 C44.2
NetC43_2: C43.2 R37.1(A) R38.1(A) R39.2(B) VD13.1(A)
NetR38_2: R38.2(B) VD14.1

### Library data of the parts
C43 C44 = SUPERCAP_10F: Value: DRE10/2.5
R37 = RC2512: Resistor 2512 1W; Value: 22E
R38 R39 = RC0603
  R38: Value: 560E
  R39: Value: 1k
VD13 = SK34SMA: Schottky Rectifier; Value: {Value}
VD14 = LED_0805: Value: LED_0805

## Sheet [14]-CURRENT_METER.SchDoc
size A4
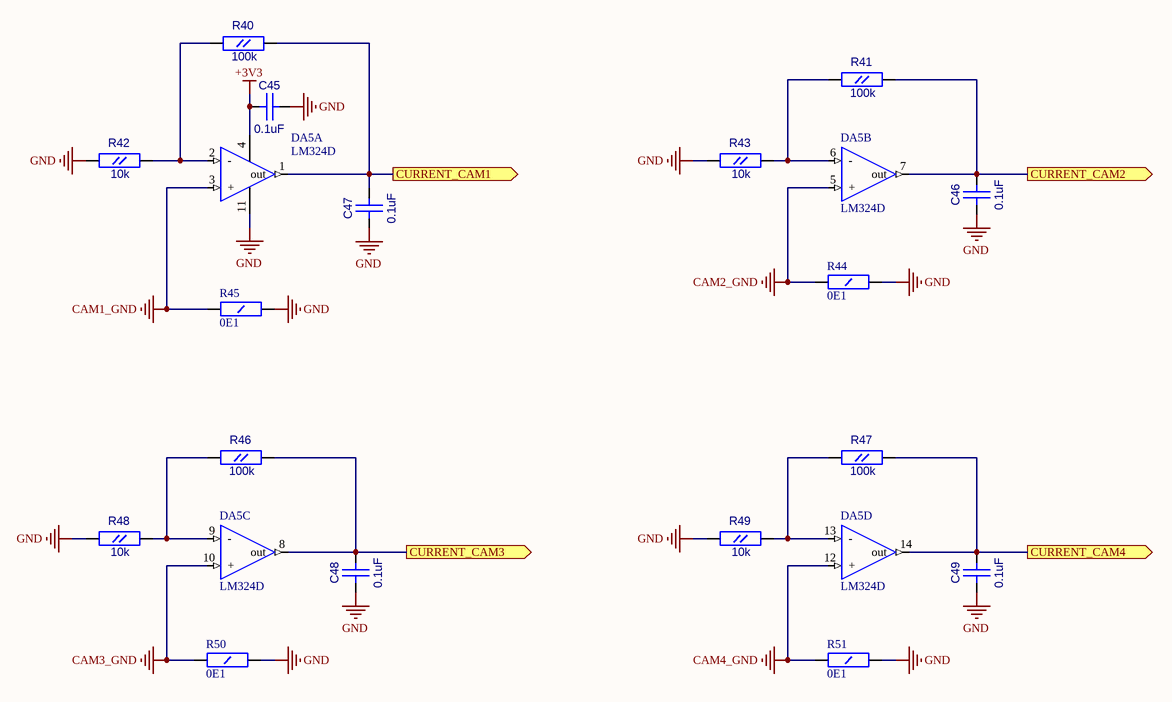
[diagram p13: [14]-CURRENT_METER.SchDoc]

### Parts
C45  0.1uF  [CC0603]
C46  0.1uF  [CC0603]
C47  0.1uF  [CC0603]
C48  0.1uF  [CC0603]
C49  0.1uF  [CC0603]
DA5  LM324D  [SO14]  (parts A,B,C,D of 4)
R40  100k  [RC0603]
R41  100k  [RC0603]
R42  10k  [RC0603]
R43  10k  [RC0603]
R44  0E1  [R2512]
R45  0E1  [R2512]
R46  100k  [RC0603]
R47  100k  [RC0603]
R48  10k  [RC0603]
R49  10k  [RC0603]
R50  0E1  [R2512]
R51  0E1  [R2512]

### Ports
CURRENT_CAM1 (out), CURRENT_CAM2 (out), CURRENT_CAM3 (out), CURRENT_CAM4 (out)

### Nets
+3V3: C45.1(A) DA5.4(V+)
CAM1_GND: DA5.3(+) R45.2(B)
CAM2_GND: DA5.5(+) R44.2(B)
CAM3_GND: DA5.10(+) R50.2(B)
CAM4_GND: DA5.12(+) R51.2(B)
GND: C45.2(B) C46.1(A) C47.1(A) C48.1(A) C49.1(A) DA5.11(V-) R42.1(A) R43.1(A) R44.1(A) R45.1(A) R48.1(A) R49.1(A) R50.1(A) R51.1(A)
CURRENT_CAM1: C47.2(B) DA5.1(out) R40.2(B) ; port CURRENT_CAM1
CURRENT_CAM2: C46.2(B) DA5.7(out) R41.2(B) ; port CURRENT_CAM2
CURRENT_CAM3: C48.2(B) DA5.8(out) R46.2(B) ; port CURRENT_CAM3
CURRENT_CAM4: C49.2(B) DA5.14(out) R47.2(B) ; port CURRENT_CAM4
NetDA5_2: DA5.2(-) R40.1(A) R42.2(B)
NetDA5_6: DA5.6(-) R41.1(A) R43.2(B)
NetDA5_9: DA5.9(-) R46.1(A) R48.2(B)
NetDA5_13: DA5.13(-) R47.1(A) R49.2(B)

### Library data of the parts
C45-C49 = CC0603: Value: 0.1uF
R40-R43 R46-R49 = RC0603
  R40 R41 R46 R47: Value: 100k
  R42 R43 R48 R49: Value: 10k
R44 R45 R50 R51 = RC2512: Resistor 2512 1W; Value: 0E1
DA5 = LM324D: Value: LM324D

## Sheet [15]-CLOCK.SchDoc
size A4
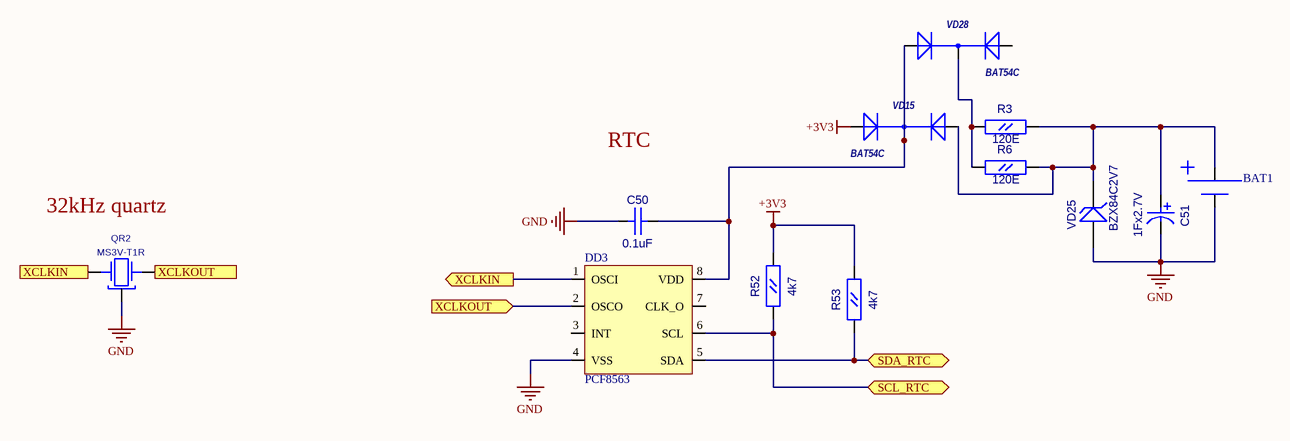
[diagram p14: [15]-CLOCK.SchDoc]

### Parts
BAT1  CR2032-VBY4  [CR2032_ONBOARD]  (value not drawn)
C50  0.1uF  [CC0603]
C51  1Fx2.7V  [CC8X11.5_L]
DD3  PCF8563  [SO-8]
QR2  MS3V-T1R  [MS3V-T1R]
R3  120E  [RC0805]
R6  120E  [RC0805]
R52  4k7  [RC0603]
R53  4k7  [RC0603]
VD15  BAT54C  [SOT-23(123)]
VD25  BZX84C2V7  [SOT-23(123)]
VD28  BAT54C  [SOT-23(123)]

### Ports
SCL_RTC (bidir), SDA_RTC (bidir), XCLKIN (in), XCLKIN (out), XCLKOUT (in), XCLKOUT (out)

### Nets
+3V3: R52.2(B) R53.2(B) VD15.1(A)
GND: BAT1.1 C50.1(A) C51.2 DD3.4(VSS) QR2.3 VD25.1(A)
SCL_RTC: DD3.6(SCL) R52.1(A) ; port SCL_RTC
SDA_RTC: DD3.5(SDA) R53.1(A) ; port SDA_RTC
NetBAT1_2: BAT1.2 C51.1 R3.2(B) R6.2(B) VD15.2(A) VD25.3(K)
NetC50_2: C50.2(B) DD3.8(VDD) VD15.3(K) VD28.1(A)
NetDD3_1: DD3.1(OSCI) QR2.2(X2) ; port XCLKIN
NetDD3_2: DD3.2(OSCO) QR2.1(X1) ; port XCLKOUT
NetR3_1: R3.1(A) R6.1(A) VD28.3(K)

Not connected (* = marked no-connect by the designer): DD3 3(INT) 7(CLK_O); VD28 2(A)

### Notes on the sheet
- RTC
- (near QR2) 32kHz quartz

### Library data of the parts
BAT1 = CR2032-VBY2: Value: CR2032-VBY4
C50 = CC0603: Value: 0.1uF
C51 = CAP_8mm: Radial capacitor; Value: 1Fx2.7V
QR2 = MS3V-T1R: CRYSTAL_32768 Hz; Value: MS3V-T1R
R3 R6 = RC0805: Value: 120E
R52 R53 = RC0603: Value: 4k7
VD25 = BZX84: Zener Voltage Regulator Diode; Value: BZX84C2V7
DD3 = PCF8563: Value: PCF8563
VD15 VD28 = BAT54C: Value: *

## Sheet [16]-ETH_SWITCH.SchDoc
size A4
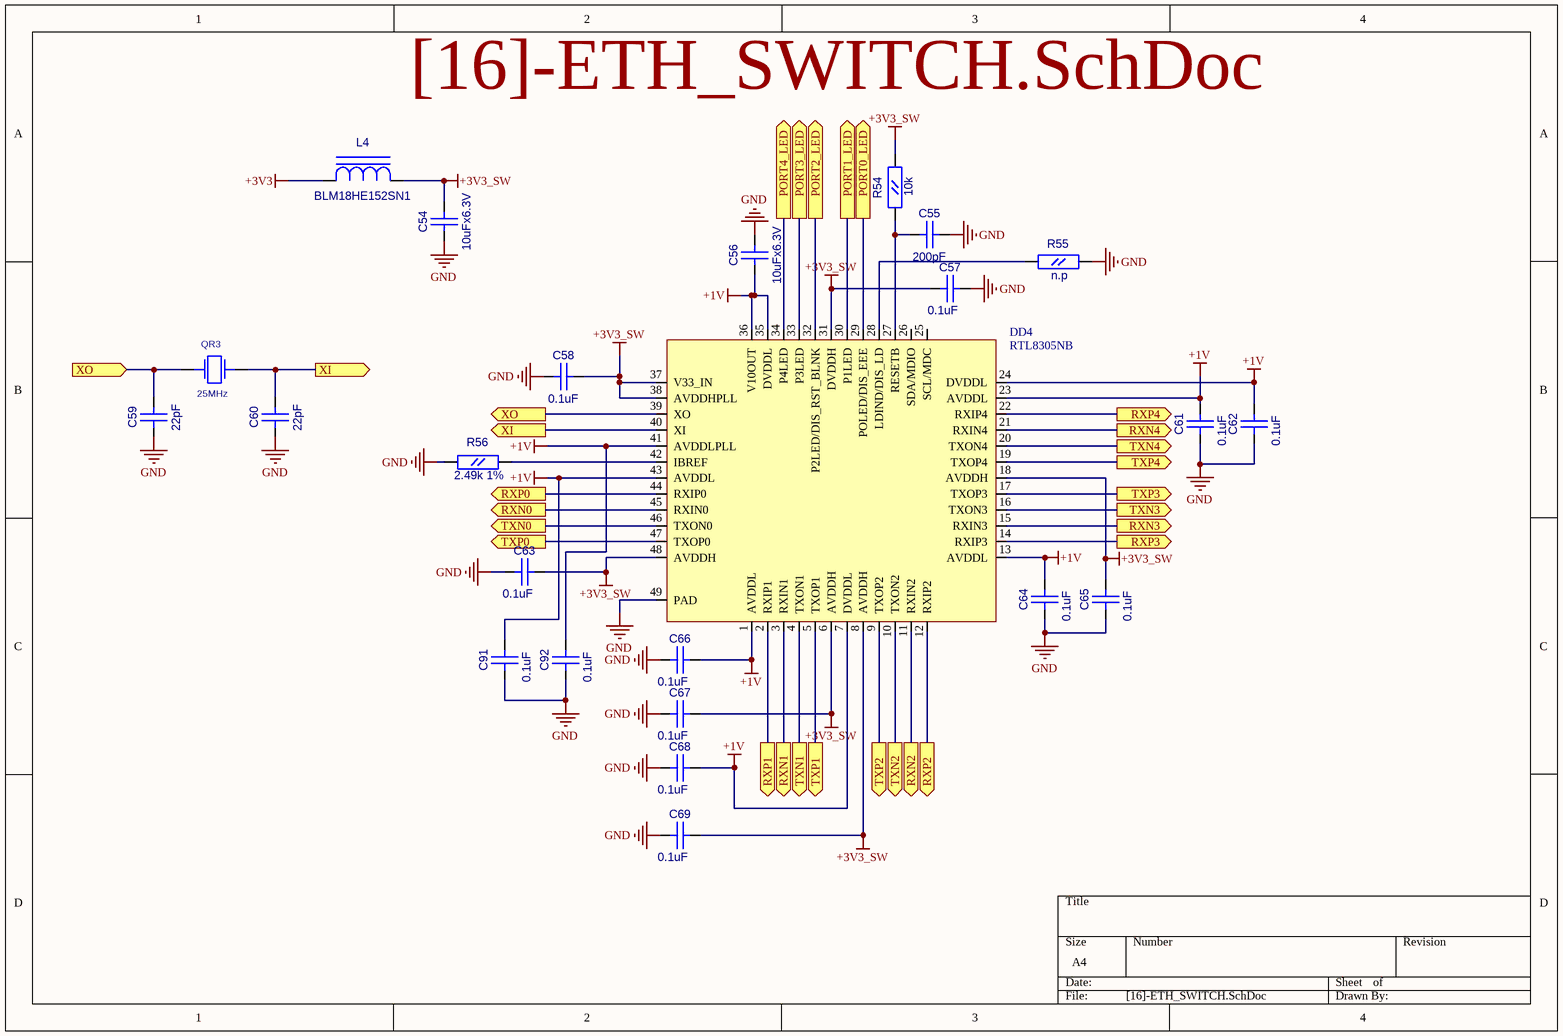
[diagram p15: [16]-ETH_SWITCH.SchDoc]

### Parts
C54  10uFx6.3V  [CC0805]
C55  200pF  [CC0603]
C56  10uFx6.3V  [CC0805]
C57  0.1uF  [CC0603]
C58  0.1uF  [CC0603]
C59  22pF  [CC0603]
C60  22pF  [CC0603]
C61  0.1uF  [CC0603]
C62  0.1uF  [CC0603]
C63  0.1uF  [CC0603]
C64  0.1uF  [CC0603]
C65  0.1uF  [CC0603]
C66  0.1uF  [CC0603]
C67  0.1uF  [CC0603]
C68  0.1uF  [CC0603]
C69  0.1uF  [CC0603]
C91  0.1uF  [CC0603]
C92  0.1uF  [CC0603]
DD4  RTL8305NB  [QFN48_ISL]
L4  BLM18HE152SN1  [L0603]
QR3  25MHz  [AC5032_2]
R54  10k  [RC0603]
R55  n.p  [RC0603]
R56  2.49k 1%  [RC0603]

### Ports
PORT0_LED (out), PORT1_LED (out), PORT2_LED (out), PORT3_LED (out), PORT4_LED (out), RXN0 (out), RXN1 (out), RXN2 (out), RXN3 (out), RXN4 (out), RXP0 (out), RXP1 (out), RXP2 (out), RXP3 (out), RXP4 (out), TXN0 (out), TXN1 (out), TXN2 (out), TXN3 (out), TXN4 (out), TXP0 (out), TXP1 (out), TXP2 (out), TXP3 (out), TXP4 (out), XI (out), XO (in), XO (out)

### Nets
+1V: C56.1(A) C61.2(B) C62.2(B) C64.2(B) C66.2(B) C68.2(B) C91.2(B) C92.2(B) DD4.1(AVDDL) DD4.7(DVDDL) DD4.13(AVDDL) DD4.23(AVDDL) DD4.24(DVDDL) DD4.35(DVDDL) DD4.36(V10OUT) DD4.41(AVDDLPLL) DD4.43(AVDDL)
+3V3: L4.1(A)
+3V3_SW: C54.2(B) C57.1(A) C58.2(B) C63.2(B) C65.2(B) C67.2(B) C69.2(B) DD4.6(AVDDH) DD4.8(AVDDH) DD4.18(AVDDH) DD4.31(DVDDH) DD4.37(V33_IN) DD4.38(AVDDHPLL) DD4.48(AVDDH) L4.2(C) R54.2(B)
GND: C54.1(A) C55.2(B) C56.2(B) C57.2(B) C58.1(A) C59.1(A) C60.1(A) C61.1(A) C62.1(A) C63.1(A) C64.1(A) C65.1(A) C66.1(A) C67.1(A) C68.1(A) C69.1(A) C91.1(A) C92.1(A) DD4.49(PAD) R55.2(B) R56.1(A)
NetC55_1: C55.1(A) DD4.27(RESETB) R54.1(A)
NetC59_2: C59.2(B) DD4.39(XO) QR3.1 ; port XO
NetC60_2: C60.2(B) DD4.40(XI) QR3.2 ; port XI
NetDD4_2: DD4.2(RXIP1) ; port RXP1
NetDD4_3: DD4.3(RXIN1) ; port RXN1
NetDD4_4: DD4.4(TXON1) ; port TXN1
NetDD4_5: DD4.5(TXOP1) ; port TXP1
NetDD4_9: DD4.9(TXOP2) ; port TXP2
NetDD4_10: DD4.10(TXON2) ; port TXN2
NetDD4_11: DD4.11(RXIN2) ; port RXN2
NetDD4_12: DD4.12(RXIP2) ; port RXP2
NetDD4_14: DD4.14(RXIP3) ; port RXP3
NetDD4_15: DD4.15(RXIN3) ; port RXN3
NetDD4_16: DD4.16(TXON3) ; port TXN3
NetDD4_17: DD4.17(TXOP3) ; port TXP3
NetDD4_19: DD4.19(TXOP4) ; port TXP4
NetDD4_20: DD4.20(TXON4) ; port TXN4
NetDD4_21: DD4.21(RXIN4) ; port RXN4
NetDD4_22: DD4.22(RXIP4) ; port RXP4
NetDD4_28: DD4.28(LDIND/DIS_LD) R55.1(A)
NetDD4_29: DD4.29(POLED/DIS_EEE) ; port PORT0_LED
NetDD4_30: DD4.30(P1LED) ; port PORT1_LED
NetDD4_32: DD4.32(P2LED/DIS_RST_BLNK) ; port PORT2_LED
NetDD4_33: DD4.33(P3LED) ; port PORT3_LED
NetDD4_34: DD4.34(P4LED) ; port PORT4_LED
NetDD4_42: DD4.42(IBREF) R56.2(B)
NetDD4_44: DD4.44(RXIP0) ; port RXP0
NetDD4_45: DD4.45(RXIN0) ; port RXN0
NetDD4_46: DD4.46(TXON0) ; port TXN0
NetDD4_47: DD4.47(TXOP0) ; port TXP0

Not connected (* = marked no-connect by the designer): DD4 25(SCL/MDC) 26(SDA/MDIO)

### Library data of the parts
C54 C56 = CC0805: Value: 10uFx6.3V
C55 C57-C69 C91 C92 = CC0603
  C55: Value: 200pF
  C57 C58 C61-C69 C91 C92: Value: 0.1uF
  C59 C60: Value: 22pF
L4 = L0603: Value: BLM18HE152SN1
QR3 = AC5032_2: AC5032/2; Value: 25MHz
R54-R56 = RC0603
  R54: Value: 10k
  R55: Value: n.p
  R56: Value: 2.49k 1%
DD4 = RTL8305NB: Value: RTL8305NB

## Sheet [18]-WIFI_MODULE.SchDoc
size A4
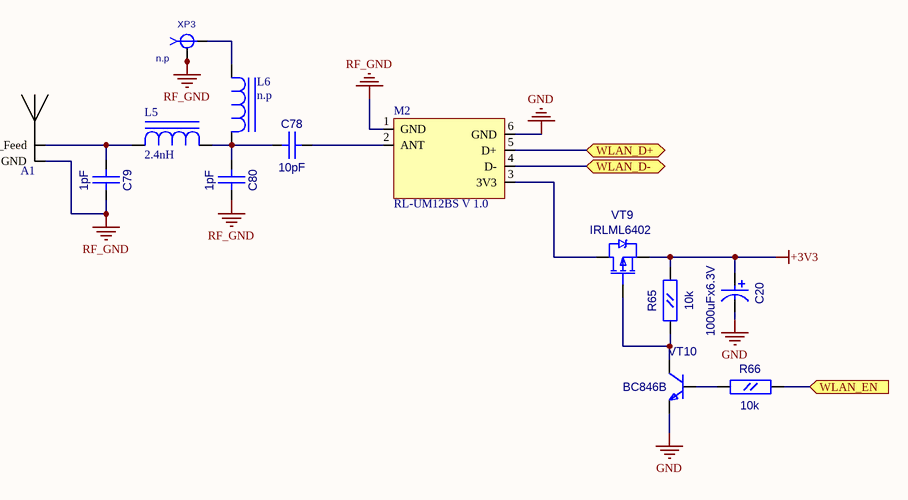
[diagram p16: [18]-WIFI_MODULE.SchDoc]

### Parts
A1  Antenna Wi-Fi  [Antenna_WiFi]  (value not drawn)
C20  1000uFx6.3V  [CC8X11.5_L]
C78  10pF  [CC0603]
C79  1pF  [CC0603]
C80  1pF  [CC0603]
L5  2.4nH  [L0402]
L6  n.p  [L0402]
M2  RL-UM12BS V 1.0  [RTL8188_MODULE]
R65  10k  [RC0603]
R66  10k  [RC0603]
VT9  IRLML6402  [SOT-23(123)]
VT10  BC846B  [SOT-23(123)]
XP3  n.p  [SMA-JR]

### Ports
WLAN_D+ (bidir), WLAN_D- (bidir), WLAN_EN (in)

### Nets
+3V3: C20.1 R65.2(B) VT9.2(S)
GND: C20.2 M2.6(GND) VT10.2(E)
RF_GND: A1.2(GND) C79.2(B) C80.2(B) M2.1(GND) XP3.2 XP3.3 XP3.4 XP3.5
WLAN_D+: M2.5(D+) ; port WLAN_D+
WLAN_D-: M2.4(D-) ; port WLAN_D-
WLAN_EN: R66.2(B) ; port WLAN_EN
NetA1_1: A1.1(RF_Feed) C79.1(A) L5.1(A)
NetC78_1: C78.1(A) C80.1(A) L5.2(C) L6.2(C)
NetC78_2: C78.2(B) M2.2(ANT)
NetL6_1: L6.1(A) XP3.1
NetM2_3: M2.3(3V3) VT9.3(D)
NetR65_1: R65.1(A) VT9.1(G) VT10.3(C)
NetR66_1: R66.1(A) VT10.1(B)

### Library data of the parts
A1 = Antenna Wi-Fi: 2.43GHz
C20 = CAP_8mm: Radial capacitor; Value: 1000uFx6.3V
C78-C80 = CC0603
  C78: Value: 10pF
  C79 C80: Value: 1pF
L5 L6 = L0402
  L5: Value: 2.4nH
  L6: Value: n.p
M2 = RTL8188_MODULE: Value: RL-UM12BS V 1.0
R65 R66 = RC0603: Value: 10k
VT9 = IRLML6402: as VT1 on sheet [7]-H3_POWER; Value: IRLML6402
VT10 = BC846BLT1: ComponentField7: Published 29-Sep-2000; OriginalName: BC846BLT1; Value: BC846B
XP3 = SMA-JR: Value: *

## Sheet [19]-CAMERA_PWR_CONNECTORS.SchDoc
size A4
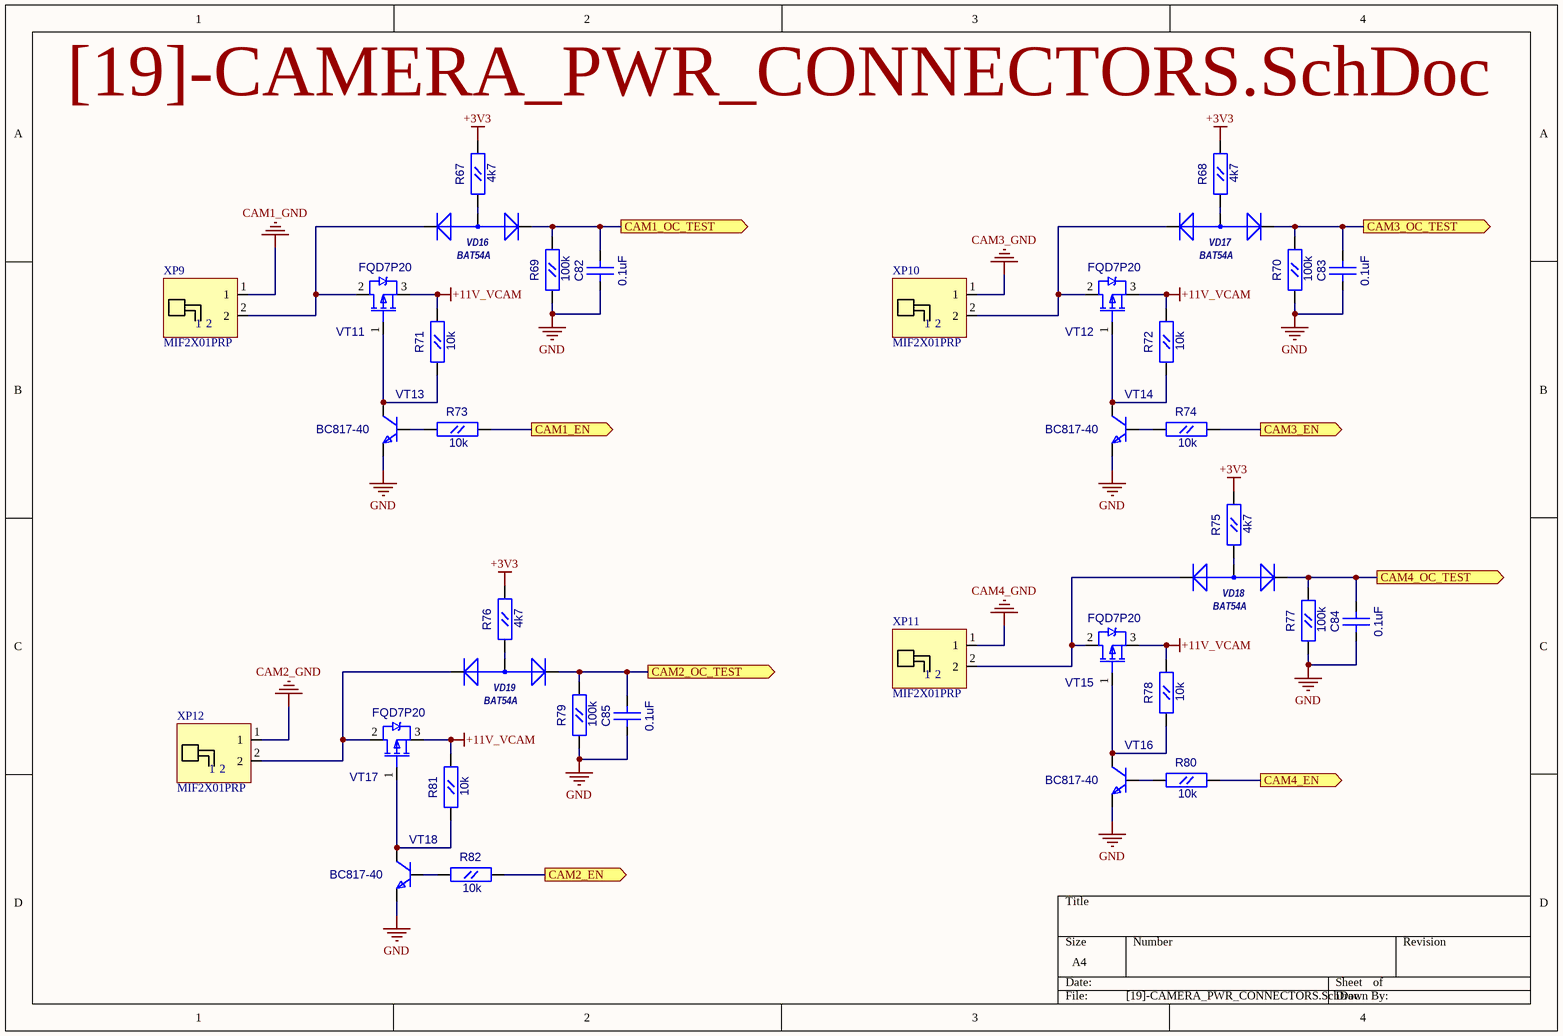
[diagram p17: [19]-CAMERA_PWR_CONNECTORS.SchDoc]

### Parts
C82  0.1uF  [CC0603]
C83  0.1uF  [CC0603]
C84  0.1uF  [CC0603]
C85  0.1uF  [CC0603]
R67  4k7  [RC0603]
R68  4k7  [RC0603]
R69  100k  [RC0603]
R70  100k  [RC0603]
R71  10k  [RC0603]
R72  10k  [RC0603]
R73  10k  [RC0603]
R74  10k  [RC0603]
R75  4k7  [RC0603]
R76  4k7  [RC0603]
R77  100k  [RC0603]
R78  10k  [RC0603]
R79  100k  [RC0603]
R80  10k  [RC0603]
R81  10k  [RC0603]
R82  10k  [RC0603]
VD16  BAT54A  [SOT-23(123)]
VD17  BAT54A  [SOT-23(123)]
VD18  BAT54A  [SOT-23(123)]
VD19  BAT54A  [SOT-23(123)]
VT11  FQD7P20  [D-PAK(TO-252AA)]
VT12  FQD7P20  [D-PAK(TO-252AA)]
VT13  BC817-40  [SOT-23(123)]
VT14  BC817-40  [SOT-23(123)]
VT15  FQD7P20  [D-PAK(TO-252AA)]
VT16  BC817-40  [SOT-23(123)]
VT17  FQD7P20  [D-PAK(TO-252AA)]
VT18  BC817-40  [SOT-23(123)]
XP9  MIF2X01PRP  [MIF2x01PRP]
XP10  MIF2X01PRP  [MIF2x01PRP]
XP11  MIF2X01PRP  [MIF2x01PRP]
XP12  MIF2X01PRP  [MIF2x01PRP]

### Ports
CAM1_EN (out), CAM1_OC_TEST (out), CAM2_EN (out), CAM2_OC_TEST (out), CAM3_EN (out), CAM3_OC_TEST (out), CAM4_EN (out), CAM4_OC_TEST (out)

### Nets
+3V3: R67.2(B) R68.2(B) R75.2(B) R76.2(B)
+11V_VCAM: R71.2(B) R72.2(B) R78.2(B) R81.2(B) VT11.3(S) VT12.3(S) VT15.3(S) VT17.3(S)
CAM1_GND: XP9.1
CAM2_GND: XP12.1
CAM3_GND: XP10.1
CAM4_GND: XP11.1
GND: C82.1(A) C83.1(A) C84.1(A) C85.1(A) R69.1(A) R70.1(A) R77.1(A) R79.1(A) VT13.2(E) VT14.2(E) VT16.2(E) VT18.2(E)
CAM1_EN: R73.2(B) ; port CAM1_EN
CAM2_EN: R82.2(B) ; port CAM2_EN
CAM3_EN: R74.2(B) ; port CAM3_EN
CAM4_EN: R80.2(B) ; port CAM4_EN
NetC82_2: C82.2(B) R69.2(B) VD16.2(K) ; port CAM1_OC_TEST
NetC83_2: C83.2(B) R70.2(B) VD17.2(K) ; port CAM3_OC_TEST
NetC84_2: C84.2(B) R77.2(B) VD18.2(K) ; port CAM4_OC_TEST
NetC85_2: C85.2(B) R79.2(B) VD19.2(K) ; port CAM2_OC_TEST
NetR67_1: R67.1(A) VD16.3(A)
NetR68_1: R68.1(A) VD17.3(A)
NetR71_1: R71.1(A) VT11.1(G) VT13.3(C)
NetR72_1: R72.1(A) VT12.1(G) VT14.3(C)
NetR73_1: R73.1(A) VT13.1(B)
NetR74_1: R74.1(A) VT14.1(B)
NetR75_1: R75.1(A) VD18.3(A)
NetR76_1: R76.1(A) VD19.3(A)
NetR78_1: R78.1(A) VT15.1(G) VT16.3(C)
NetR80_1: R80.1(A) VT16.1(B)
NetR81_1: R81.1(A) VT17.1(G) VT18.3(C)
NetR82_1: R82.1(A) VT18.1(B)
NetVD16_1: VD16.1(K) VT11.2(D) XP9.2
NetVD17_1: VD17.1(K) VT12.2(D) XP10.2
NetVD18_1: VD18.1(K) VT15.2(D) XP11.2
NetVD19_1: VD19.1(K) VT17.2(D) XP12.2

### Library data of the parts
C82-C85 = CC0603: Value: 0.1uF
R67-R82 = RC0603
  R67 R68 R75 R76: Value: 4k7
  R69 R70 R77 R79: Value: 100k
  R71-R74 R78 R80-R82: Value: 10k
VD16-VD19 = BAT54A: 1.0 Ampere General Purpose Rectifier; ComponentField6: Published 8-Jun-2000, Modified 11-July-2000: SIM Model Added.; Value: *
VT11 VT12 VT15 VT17 = IRFR9220: as VT5 on sheet [11]-MAIN_POWER; Value: FQD7P20
VT13 VT14 VT16 VT18 = BC846BLT1: NPN 500ma transistor; ComponentField7: Published 29-Sep-2000; OriginalName: BC846BLT1; Value: BC817-40
XP9-XP12 = MIF2X01PRP: Molex connector 3.0mm pitch; Value: MIF2X01PRP

## Sheet [20]-CONNECT_CONNECTORS.SchDoc
size A4
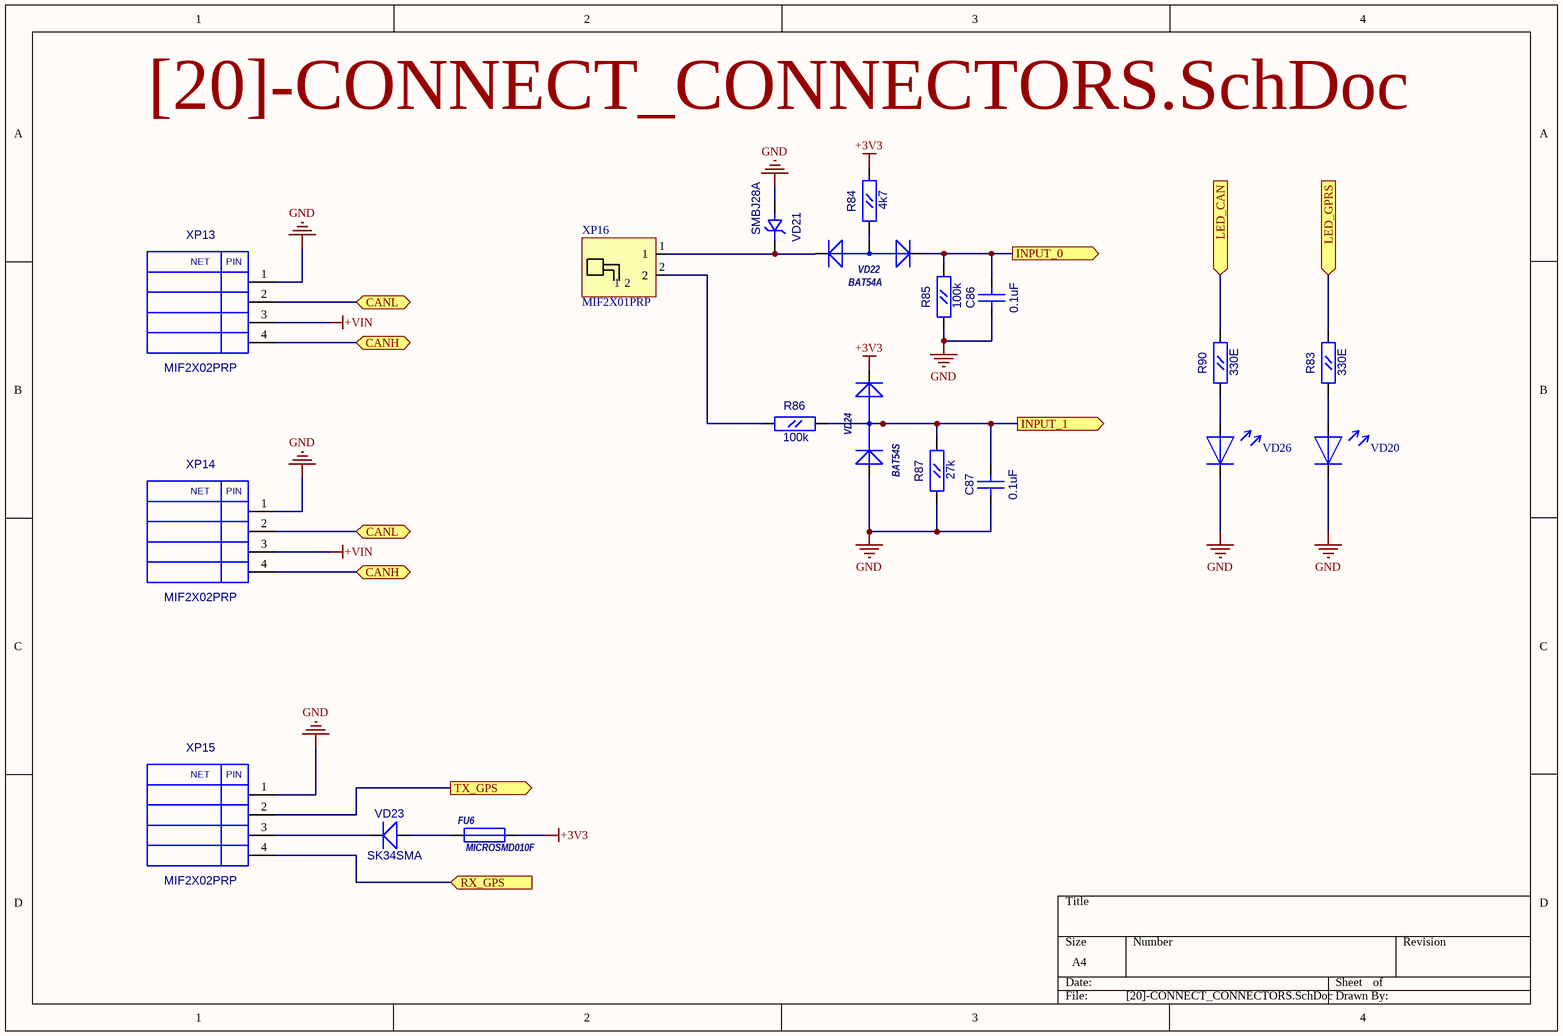
[diagram p18: [20]-CONNECT_CONNECTORS.SchDoc]

### Parts
C86  0.1uF  [CC0603]
C87  0.1uF  [CC0603]
FU6  MICROSMD010F  [RC1210]
R83  330E  [RC0603]
R84  4k7  [RC0603]
R85  100k  [RC0603]
R86  100k  [RC0603]
R87  27k  [RC0603]
R90  330E  [RC0603]
VD20  LED_0805  [LED0805]  (value not drawn)
VD21  SMBJ28A  [SMB]
VD22  BAT54A  [SOT-23(123)]
VD23  SK34SMA  [SMA]
VD24  BAT54S  [SOT-23(GSD)]
VD26  LED_0805  [LED0805]  (value not drawn)
XP13  MIF2X02PRP  [MIF2X02PRP]
XP14  MIF2X02PRP  [MIF2X02PRP]
XP15  MIF2X02PRP  [MIF2X02PRP]
XP16  MIF2X01PRP  [MIF2x01PRP]

### Ports
CANH (bidir), CANL (bidir), INPUT_0 (out), INPUT_1 (out), LED_CAN (in), LED_GPRS (in), RX_GPS (in), TX_GPS (out)

### Nets
+3V3: FU6.2 R84.2(B) VD24.2(K)
+VIN: XP13.3 XP14.3
GND: C86.1(A) C87.1(A) R85.1(A) R87.1(A) VD20.2 VD21.1(A) VD24.1(A) VD26.2 XP13.1 XP14.1 XP15.1
INPUT_0: C86.2(B) R85.2(B) VD22.2(K) ; port INPUT_0
INPUT_1: C87.2(B) R86.2(B) R87.2(B) VD24.3(AK) ; port INPUT_1
LED_CAN: R90.2(B) ; port LED_CAN
LED_GPRS: R83.2(B) ; port LED_GPRS
RX_GPS: XP15.4 ; port RX_GPS
TX_GPS: XP15.2 ; port TX_GPS
NetFU1_2: XP13.2 XP14.2 ; port CANL
NetFU2_2: XP13.4 XP14.4 ; port CANH
NetFU6_1: FU6.1 VD23.1(A)
NetR83_1: R83.1(A) VD20.1
NetR84_1: R84.1(A) VD22.3(A)
NetR86_1: R86.1(A) XP16.2
NetR90_1: R90.1(A) VD26.1
NetVD21_2: VD21.2(K) VD22.1(K) XP16.1
NetVD23_2: VD23.2(K) XP15.3

### Notes on the sheet
- (in symbol MIF2X02PRP) NET; PIN

### Library data of the parts
C86 C87 = CC0603: Value: 0.1uF
FU6 = MICROSMD: Value: MICROSMD010F
R83-R87 R90 = RC0603
  R83 R90: Value: 330E
  R84: Value: 4k7
  R85 R86: Value: 100k
  R87: Value: 27k
VD21 = SMBJ: Value: SMBJ28A
VD22 = BAT54A: as VD16 on sheet [19]-CAMERA_PWR_CONNECTORS; Value: *
VD23 = SK34SMA: Schottky Rectifier; Value: {Value}
VD24 = BAT54S: as VD1 on sheet [4]-MCU_POWER; Value: *
XP16 = MIF2X01PRP: Molex connector 3.0mm pitch; Value: MIF2X01PRP
VD20 VD26 = LED_0805: Value: LED_0805
XP13-XP15 = MIF2X02PRP: Value: *

## Sheet [21]-AXEL.SchDoc
size A4
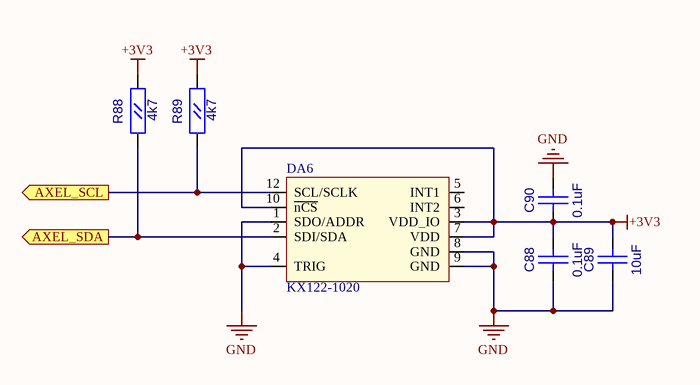
[diagram p19: [21]-AXEL.SchDoc]

### Parts
C88  0.1uF  [CC0603]
C89  10uF  [CC0805]
C90  0.1uF  [CC0603]
DA6  KX122-1020  [LGA-12]
R88  4k7  [RC0603]
R89  4k7  [RC0603]

### Ports
AXEL_SCL (out), AXEL_SDA (out)

### Nets
+3V3: C88.2(B) C89.2(B) C90.1(A) DA6.3(VDD_IO) DA6.7(VDD) DA6.10(~{nCS}) R88.2(B) R89.2(B)
GND: C88.1(A) C89.1(A) C90.2(B) DA6.1(SDO/ADDR) DA6.4(TRIG) DA6.8(GND) DA6.9(GND)
NetDA6_2: DA6.2(SDI/SDA) R88.1(A) ; port AXEL_SDA
NetDA6_12: DA6.12(SCL/SCLK) R89.1(A) ; port AXEL_SCL

Not connected (* = marked no-connect by the designer): DA6 5(INT1) 6(INT2)

### Library data of the parts
C88 C90 = CC0603: Value: 0.1uF
C89 = CC0805: Value: 10uF
DA6 = KX022-1020: Value: KX122-1020
R88 R89 = RC0603: Value: 4k7

## Nets that join several sheets
+3V3: [3]-MCU_MAIN (11 pins), [4]-MCU_POWER (C11.2 C93.1 DA1.2 VD1.2), [5]-MCU_CONNECTORS (R8.2 R10.1 XP1.1), [14]-CURRENT_METER (C45.1 DA5.4), [15]-CLOCK (R52.2 R53.2 VD15.1), [16]-ETH_SWITCH (L4.1), [18]-WIFI_MODULE (C20.1 R65.2 VT9.2), [19]-CAMERA_PWR_CONNECTORS (R67.2 R68.2 R75.2 R76.2), [20]-CONNECT_CONNECTORS (FU6.2 R84.2 VD24.2), [21]-AXEL (8 pins)
+4V35: [4]-MCU_POWER (C8.1 C9.2 DA1.3), [7]-H3_POWER (5 pins), [8]-MODEM_MAIN (R18.2 VT3.2), [9]-MODEM_POWER (C22.1 C23.1 L2.2 R20.2), [13]-BACKUP_POWER (R37.2 VD13.2)
+5V: [3]-MCU_MAIN (C3.2 DD1.20), [7]-H3_POWER (9 pins)
+11V_VCAM: [12]-CAMERA_POWER (VD8.2 VT7.2), [19]-CAMERA_PWR_CONNECTORS (8 pins)
+VIN: [11]-MAIN_POWER (FU4.1), [20]-CONNECT_CONNECTORS (XP13.3 XP14.3)
CAM1_GND: [14]-CURRENT_METER (DA5.3 R45.2), [19]-CAMERA_PWR_CONNECTORS (XP9.1)
CAM2_GND: [14]-CURRENT_METER (DA5.5 R44.2), [19]-CAMERA_PWR_CONNECTORS (XP12.1)
CAM3_GND: [14]-CURRENT_METER (DA5.10 R50.2), [19]-CAMERA_PWR_CONNECTORS (XP10.1)
CAM4_GND: [14]-CURRENT_METER (DA5.12 R51.2), [19]-CAMERA_PWR_CONNECTORS (XP11.1)
GND: [3]-MCU_MAIN (13 pins), [4]-MCU_POWER (8 pins), [5]-MCU_CONNECTORS (C12.2 C13.1 VD2.3 XP1.5), [6]-H3_MAIN (14 pins), [7]-H3_POWER (14 pins), [8]-MODEM_MAIN (7 pins), [9]-MODEM_POWER (12 pins), [10]-MODEM_CONNECTORS (5 pins), [11]-MAIN_POWER (6 pins), [12]-CAMERA_POWER (15 pins), [13]-BACKUP_POWER (C44.1 R39.1 VD14.2), [14]-CURRENT_METER (14 pins), [15]-CLOCK (6 pins), [16]-ETH_SWITCH (21 pins), [18]-WIFI_MODULE (C20.2 M2.6 VT10.2), [19]-CAMERA_PWR_CONNECTORS (12 pins), [20]-CONNECT_CONNECTORS (11 pins), [21]-AXEL (7 pins)
VIN_F: [4]-MCU_POWER (R4.1), [9]-MODEM_POWER (C24.2 C25.1 DA3.2), [11]-MAIN_POWER (R91.2 VT5.2), [12]-CAMERA_POWER (5 pins)
VUSB: [6]-H3_MAIN (8 pins), [7]-H3_POWER (VT1.3), [8]-MODEM_MAIN (XP5.9)
CAM1_EN: [6]-H3_MAIN (M1.63), [19]-CAMERA_PWR_CONNECTORS (R73.2)
CAM2_EN: [6]-H3_MAIN (M1.65), [19]-CAMERA_PWR_CONNECTORS (R82.2)
CAM3_EN: [6]-H3_MAIN (M1.67), [19]-CAMERA_PWR_CONNECTORS (R74.2)
CAM4_EN: [6]-H3_MAIN (M1.68), [19]-CAMERA_PWR_CONNECTORS (R80.2)
CANH: [3]-MCU_MAIN (DD1.19), [5]-MCU_CONNECTORS (FU2.1 R9.2 VD2.1)
CANL: [3]-MCU_MAIN (DD1.18), [5]-MCU_CONNECTORS (FU1.1 J2.1 VD2.2)
CURRENT_CAM1: [3]-MCU_MAIN (DD1.33), [14]-CURRENT_METER (C47.2 DA5.1 R40.2)
CURRENT_CAM2: [3]-MCU_MAIN (DD1.34), [14]-CURRENT_METER (C46.2 DA5.7 R41.2)
CURRENT_CAM3: [3]-MCU_MAIN (DD1.42), [14]-CURRENT_METER (C48.2 DA5.8 R46.2)
CURRENT_CAM4: [3]-MCU_MAIN (DD1.40), [14]-CURRENT_METER (C49.2 DA5.14 R47.2)
GSM_ON: [6]-H3_MAIN (M1.13), [8]-MODEM_MAIN (R19.2)
INPUT_0: [3]-MCU_MAIN (DD1.25), [6]-H3_MAIN (M1.60), [20]-CONNECT_CONNECTORS (C86.2 R85.2 VD22.2)
INPUT_1: [6]-H3_MAIN (M1.62), [20]-CONNECT_CONNECTORS (C87.2 R86.2 R87.2 VD24.3)
ISP_START: [3]-MCU_MAIN (DD1.4), [5]-MCU_CONNECTORS (C13.2 R10.2 XP1.8)
LED_CAN: [3]-MCU_MAIN (DD1.38), [20]-CONNECT_CONNECTORS (R90.2)
LED_GPRS: [6]-H3_MAIN (M1.56), [20]-CONNECT_CONNECTORS (R83.2)
MCU_RTS: [3]-MCU_MAIN (DD1.45), [6]-H3_MAIN (M1.57)
MCU_RXD: [3]-MCU_MAIN (DD1.46), [5]-MCU_CONNECTORS (XP1.7), [6]-H3_MAIN (M1.55)
MCU_TXD: [3]-MCU_MAIN (DD1.47), [5]-MCU_CONNECTORS (R7.2), [6]-H3_MAIN (M1.66)
NetC82_2: [6]-H3_MAIN (M1.2), [19]-CAMERA_PWR_CONNECTORS (C82.2 R69.2 VD16.2)
NetC83_2: [6]-H3_MAIN (M1.6), [19]-CAMERA_PWR_CONNECTORS (C83.2 R70.2 VD17.2)
NetC84_2: [6]-H3_MAIN (M1.8), [19]-CAMERA_PWR_CONNECTORS (C84.2 R77.2 VD18.2)
NetC85_2: [6]-H3_MAIN (M1.4), [19]-CAMERA_PWR_CONNECTORS (C85.2 R79.2 VD19.2)
NetDA6_2: [3]-MCU_MAIN (R93.1), [6]-H3_MAIN (M1.42), [21]-AXEL (DA6.2 R88.1)
NetDA6_12: [3]-MCU_MAIN (R92.1), [6]-H3_MAIN (M1.40), [21]-AXEL (DA6.12 R89.1)
NetDD1_24: [3]-MCU_MAIN (DD1.24), [6]-H3_MAIN (M1.59)
NetDD4_19: [6]-H3_MAIN (M1.27), [16]-ETH_SWITCH (DD4.19)
NetDD4_20: [6]-H3_MAIN (M1.28), [16]-ETH_SWITCH (DD4.20)
NetDD4_21: [6]-H3_MAIN (M1.30), [16]-ETH_SWITCH (DD4.21)
NetDD4_22: [6]-H3_MAIN (M1.29), [16]-ETH_SWITCH (DD4.22)
NetFU1_2: [5]-MCU_CONNECTORS (FU1.2), [20]-CONNECT_CONNECTORS (XP13.2 XP14.2)
NetFU2_2: [5]-MCU_CONNECTORS (FU2.2), [20]-CONNECT_CONNECTORS (XP13.4 XP14.4)
OPI_ON: [3]-MCU_MAIN (DD1.36), [7]-H3_POWER (R16.2)
RESET: [3]-MCU_MAIN (DD1.3), [5]-MCU_CONNECTORS (C12.1 R8.1 XP1.2)
RX_GPS: [6]-H3_MAIN (M1.52), [20]-CONNECT_CONNECTORS (XP15.4)
SCL_RTC: [6]-H3_MAIN (M1.49), [15]-CLOCK (DD3.6 R52.1)
SDA_RTC: [6]-H3_MAIN (M1.47), [15]-CLOCK (DD3.5 R53.1)
SIMCLK: [8]-MODEM_MAIN (XP5.8), [10]-MODEM_CONNECTORS (C31.2 XP7.3)
SIMIO: [8]-MODEM_MAIN (XP5.7), [10]-MODEM_CONNECTORS (C29.2 XP7.6)
SIMRST: [8]-MODEM_MAIN (XP5.5), [10]-MODEM_CONNECTORS (C32.2 XP7.2)
SIMVCC: [8]-MODEM_MAIN (XP5.6), [10]-MODEM_CONNECTORS (C30.2 XP7.1)
SWCLK: [3]-MCU_MAIN (DD1.29), [5]-MCU_CONNECTORS (XP1.4)
SWDIO: [3]-MCU_MAIN (DD1.39), [5]-MCU_CONNECTORS (XP1.3)
TX_GPS: [6]-H3_MAIN (M1.54), [20]-CONNECT_CONNECTORS (XP15.2)
USB_D+: [6]-H3_MAIN (M1.3), [8]-MODEM_MAIN (XP5.11)
USB_D-: [6]-H3_MAIN (M1.5), [8]-MODEM_MAIN (XP5.12)
V_IN: [3]-MCU_MAIN (DD1.32), [4]-MCU_POWER (C10.2 R4.2 R5.2 VD1.3)
WLAN_D+: [6]-H3_MAIN (M1.7), [18]-WIFI_MODULE (M2.5)
WLAN_D-: [6]-H3_MAIN (M1.9), [18]-WIFI_MODULE (M2.4)
WLAN_EN: [6]-H3_MAIN (M1.11), [18]-WIFI_MODULE (R66.2)